# Altium project P-MT3620RDB-1-7.PrjPcb (part 2 of 5)

## Sheet P-MT3620RDB-1-7_PMU.SchDoc: MT3620 RDB PMU
size A3; CompanyName: Microsoft Research; DrawnBy: Stuart Taylor; Revision: 1.7; SheetNumber: 3; SheetTotal: 5; ProjectName: MT3620 Reference Development Board
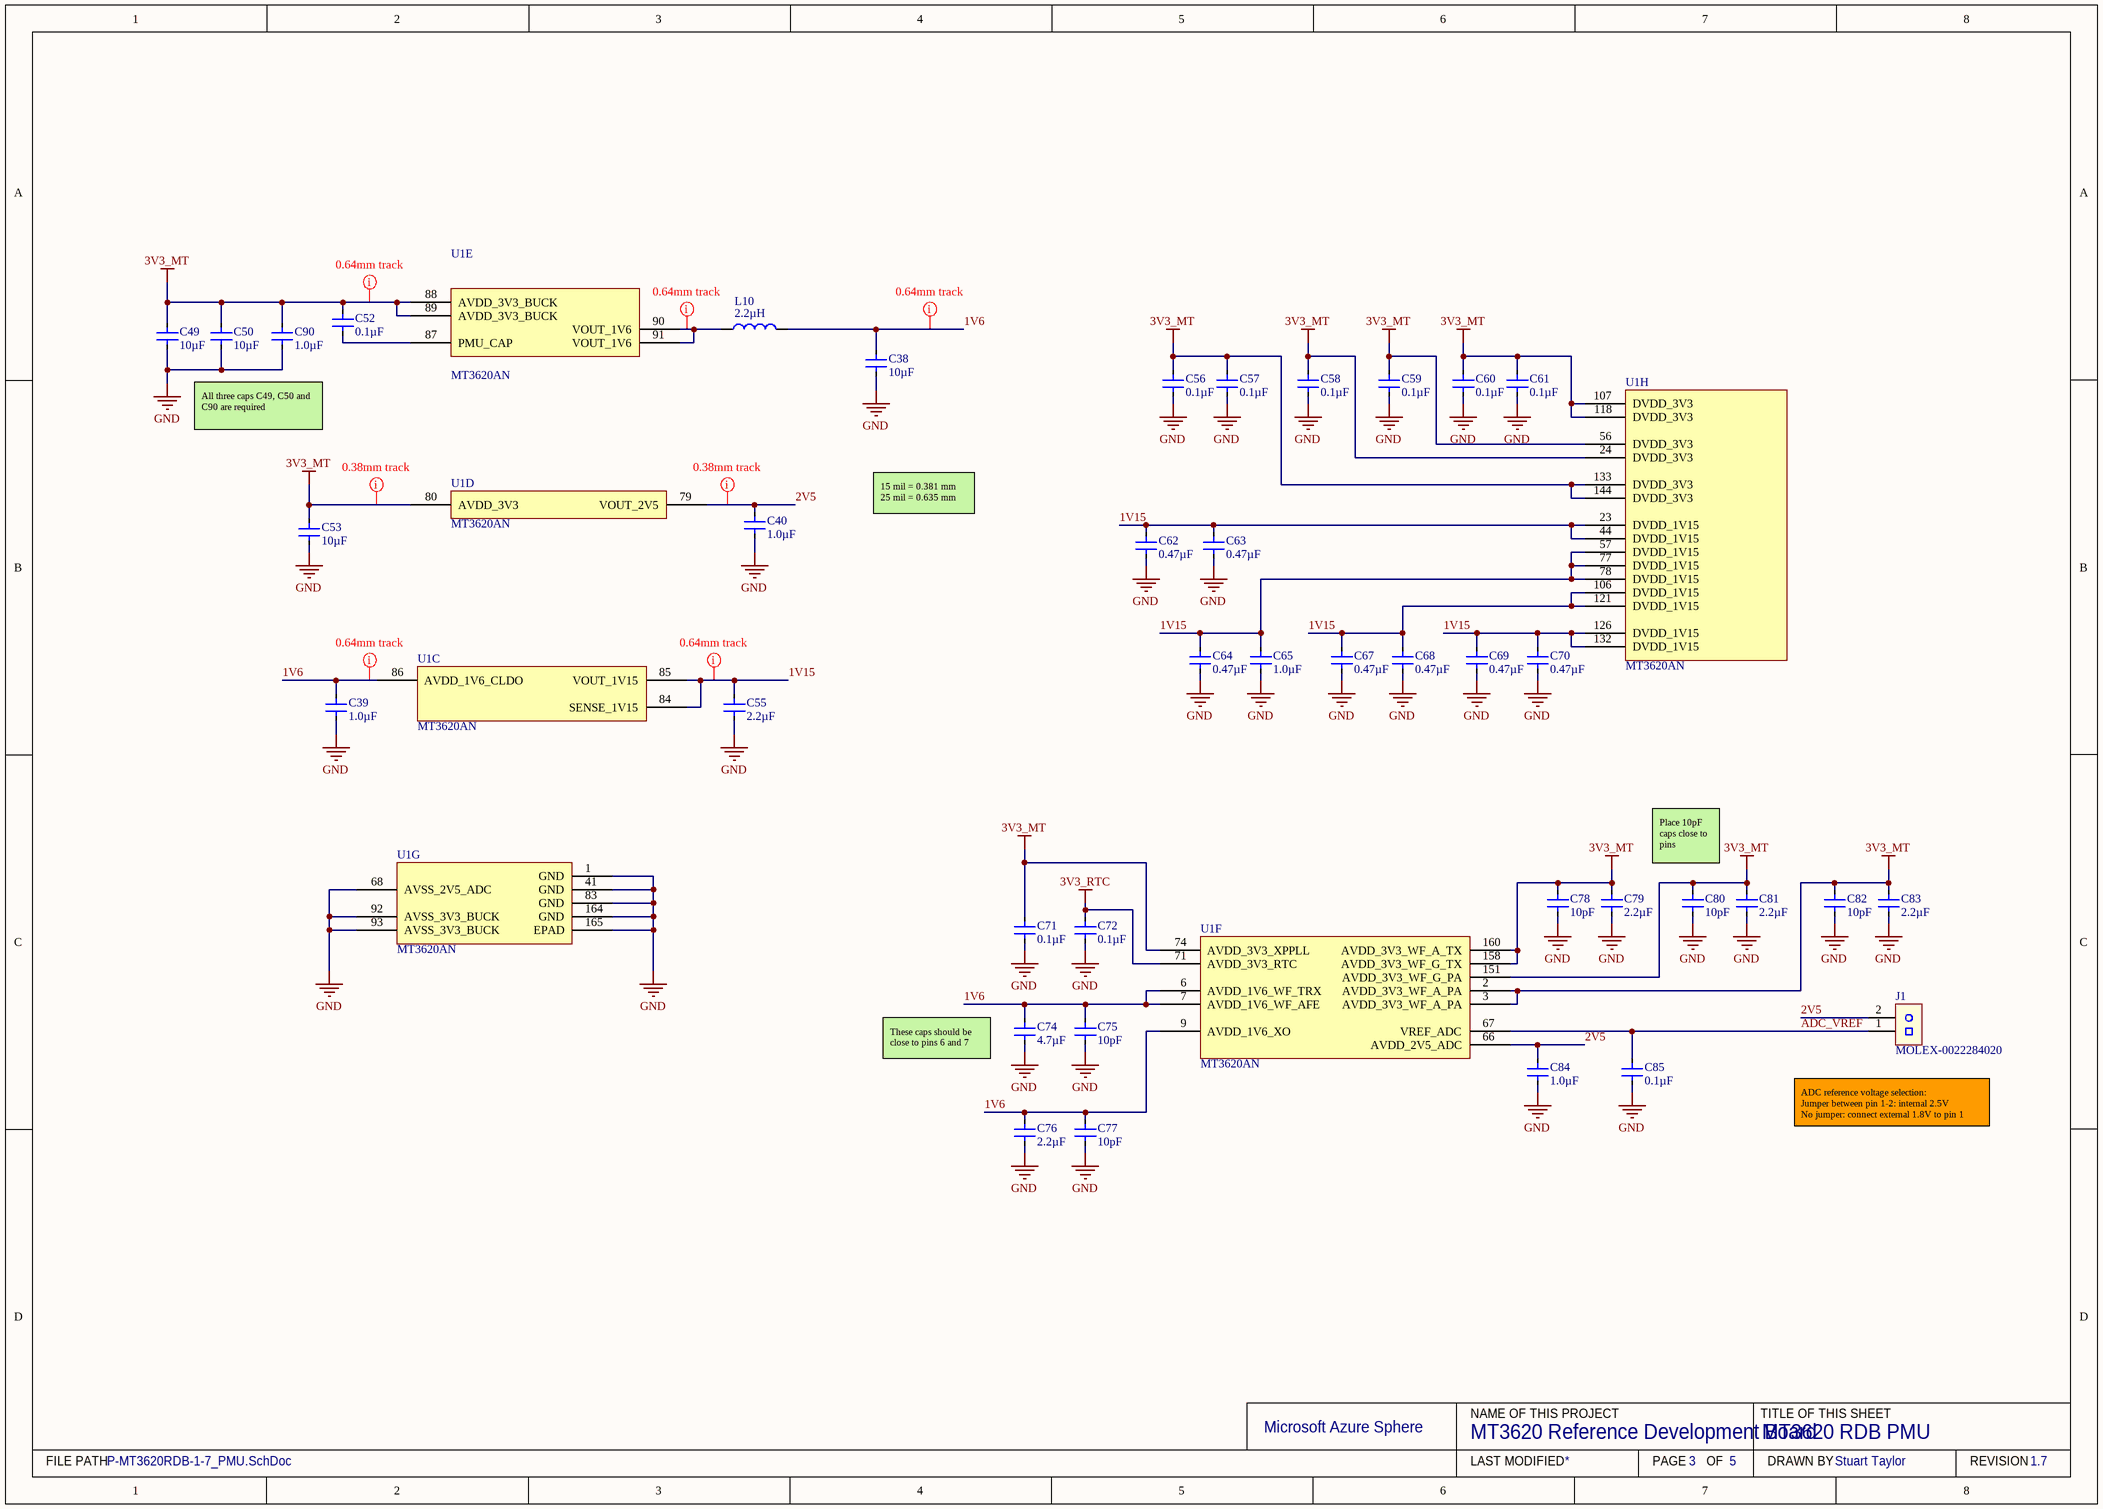
[diagram p2: P-MT3620RDB-1-7_PMU.SchDoc]

### Parts
C38  10µF  [CAPC1608-EIA0603-1MM-MED]
C39  1.0µF  [CAPC1005-EIA0402 0.55MM MED]
C40  1.0µF  [CAPC1005-EIA0402 0.55MM MED]
C49  10µF  [CAPC1005-EIA0402 0.55MM MED]
C50  10µF  [CAPC1005-EIA0402 0.55MM MED]
C52  0.1µF  [CAPC1005-EIA0402 0.55MM MED]
C53  10µF  [CAPC1005-EIA0402 0.55MM MED]
C55  2.2µF  [CAPC1005-EIA0402 0.55MM MED]
C56  0.1µF  [CAPC1005-EIA0402 0.55MM MED]
C57  0.1µF  [CAPC1005-EIA0402 0.55MM MED]
C58  0.1µF  [CAPC1005-EIA0402 0.55MM MED]
C59  0.1µF  [CAPC1005-EIA0402 0.55MM MED]
C60  0.1µF  [CAPC1005-EIA0402 0.55MM MED]
C61  0.1µF  [CAPC1005-EIA0402 0.55MM MED]
C62  0.47µF  [CAPC1005-EIA0402 0.55MM MED]
C63  0.47µF  [CAPC1005-EIA0402 0.55MM MED]
C64  0.47µF  [CAPC1005-EIA0402 0.55MM MED]
C65  1.0µF  [CAPC1005-EIA0402 0.55MM MED]
C67  0.47µF  [CAPC1005-EIA0402 0.55MM MED]
C68  0.47µF  [CAPC1005-EIA0402 0.55MM MED]
C69  0.47µF  [CAPC1005-EIA0402 0.55MM MED]
C70  0.47µF  [CAPC1005-EIA0402 0.55MM MED]
C71  0.1µF  [CAPC1005-EIA0402 0.55MM MED]
C72  0.1µF  [CAPC1005-EIA0402 0.55MM MED]
C74  4.7µF  [CAPC1005-EIA0402 0.55MM MED]
C75  10pF  [CAPC1005-EIA0402 0.55MM MED]
C76  2.2µF  [CAPC1005-EIA0402 0.55MM MED]
C77  10pF  [CAPC1005-EIA0402 0.55MM MED]
C78  10pF  [CAPC1005-EIA0402 0.55MM MED]
C79  2.2µF  [CAPC1005-EIA0402 0.55MM MED]
C80  10pF  [CAPC1005-EIA0402 0.55MM MED]
C81  2.2µF  [CAPC1005-EIA0402 0.55MM MED]
C82  10pF  [CAPC1005-EIA0402 0.55MM MED]
C83  2.2µF  [CAPC1005-EIA0402 0.55MM MED]
C84  1.0µF  [CAPC1005-EIA0402 0.55MM MED]
C85  0.1µF  [CAPC1005-EIA0402 0.55MM MED]
C90  1.0µF  [CAPC1005-EIA0402 0.55MM MED]
J1  MOLEX-0022284020  [0022284020]
L10  2.2µH  [MAMK2520T2R2M]
U1  MT3620AN  [MT3620_MaskSquaresVias50]  (parts C,D,E,F,G,H of 14)

### Nets
3V3_MT: C49.2 C50.2 C52.2 C53.2 C56.2 C57.2 C58.2 C59.2 C60.2 C61.2 C71.2 C78.2 C79.2 C80.2 C81.2 C82.2 C83.2 C90.2 U1.2(AVDD_3V3_WF_A_PA) U1.3(AVDD_3V3_WF_A_PA) U1.24(DVDD_3V3) U1.56(DVDD_3V3) U1.74(AVDD_3V3_XPPLL) U1.80(AVDD_3V3) U1.88(AVDD_3V3_BUCK) U1.89(AVDD_3V3_BUCK) U1.107(DVDD_3V3) U1.118(DVDD_3V3) U1.133(DVDD_3V3) U1.144(DVDD_3V3) U1.151(AVDD_3V3_WF_G_PA) U1.158(AVDD_3V3_WF_G_TX) U1.160(AVDD_3V3_WF_A_TX)
3V3_RTC: C72.2 U1.71(AVDD_3V3_RTC)
GND: C38.1 C39.1 C40.1 C49.1 C50.1 C53.1 C55.1 C56.1 C57.1 C58.1 C59.1 C60.1 C61.1 C62.1 C63.1 C64.1 C65.1 C67.1 C68.1 C69.1 C70.1 C71.1 C72.1 C74.1 C75.1 C76.1 C77.1 C78.1 C79.1 C80.1 C81.1 C82.1 C83.1 C84.1 C85.1 C90.1 U1.1(GND) U1.41(GND) U1.68(AVSS_2V5_ADC) U1.83(GND) U1.92(AVSS_3V3_BUCK) U1.93(AVSS_3V3_BUCK) U1.164(GND) U1.165(EPAD)
1V6: C38.2 C39.2 C74.2 C75.2 C76.2 C77.2 L10.2 U1.6(AVDD_1V6_WF_TRX) U1.7(AVDD_1V6_WF_AFE) U1.9(AVDD_1V6_XO) U1.86(AVDD_1V6_CLDO)
1V15: C55.2 C62.2 C63.2 C64.2 C65.2 C67.2 C68.2 C69.2 C70.2 U1.23(DVDD_1V15) U1.44(DVDD_1V15) U1.57(DVDD_1V15) U1.77(DVDD_1V15) U1.78(DVDD_1V15) U1.84(SENSE_1V15) U1.85(VOUT_1V15) U1.106(DVDD_1V15) U1.121(DVDD_1V15) U1.126(DVDD_1V15) U1.132(DVDD_1V15)
2V5: C40.2 C84.2 J1.2 U1.66(AVDD_2V5_ADC) U1.79(VOUT_2V5)
ADC_VREF: C85.2 J1.1 U1.67(VREF_ADC)
NetC52_1: C52.1 U1.87(PMU_CAP)
NetL10_1: L10.1 U1.90(VOUT_1V6) U1.91(VOUT_1V6)

### Layout directives
rule Undefined: 1V6, 1V15, 2V5, 3V3_MT, NetL10_1

### Notes on the sheet
- All three caps C49, C50 and C90 are required
- 15 mil = 0.381 mm
  25 mil = 0.635 mm
- Place 10pF caps close to pins
- (near C74) These caps should be close to pins 6 and 7
- (near J1) ADC reference voltage selection:
  Jumper between pin 1-2: internal 2.5V
  No jumper: connect external 1.8V to pin 1
- Microsoft Azure Sphere
- NAME OF THIS PROJECT
- TITLE OF THIS SHEET
- FILE PATH
- LAST MODIFIED
- PAGE
- OF
- DRAWN BY
- REVISION

### Library data of the parts
C38 = 10µF 0603 X5R 25V: CAP CER 10UF 25V 20% X5R 0603; Manufacturer: TDK Corporation; Manufacturer Part Number: C1608X5R1E106M080AC; Supplier 1: Digi-Key; RoHS: RoHS Compliant; Category: Capacitors; Stock 1: 47833; Pricing 1: 0.00754; Packaging: Tape & Reel (TR); Tolerance: ±20%; Voltage - Rated: 25V; Temperature Coefficient: X5R; Mounting Type: Surface Mount, MLCC; Operating Temperature: -55°C ~ 125°C; Applications: General Purpose; Package / Case: 0603 (1608 Metric); Size / Dimension: 0.063" L x 0.031" W (1.60mm x 0.80mm); Height - Seated (Max): -; Thickness (Max): 0.039" (1.00mm); Lead Spacing: -; Features: -; Lead Style: -; ComponentLink1URL: http://product.tdk.com/en/catalog/datasheets/mlcc_commercial_general_en.pdf; ComponentLink1Description: http://product.tdk.com/en/catalog/datasheets/mlcc_commercial_general_en.pdf; Supplier Part Number 1: 445-9015-2-ND; Ratings: -; Capacitance: 10µF
C39 C40 C65 C84 C90 = 1.0µF 0402 X5R 35V: CAP CER 1UF 35V 10% X5R 0402; Manufacturer: TDK Corporation; Manufacturer Part Number: C1005X5R1V105K050BC; Supplier 1: Digi-Key; RoHS: RoHS Compliant; Category: Capacitors; Stock 1: 47833; Pricing 1: 0.0186; Packaging: Tape & Reel (TR); Tolerance: ±10%; Voltage - Rated: 35V; Temperature Coefficient: X5R; Mounting Type: Surface Mount, MLCC; Operating Temperature: -55°C ~ 125°C; Applications: General Purpose; Package / Case: 0402 (1005 Metric); Size / Dimension: 0.039" L x 0.020" W (1.00mm x 0.50mm); Height - Seated (Max): -; Thickness (Max): 0.022" (0.55mm); Lead Spacing: -; Features: -; Lead Style: -; ComponentLink1URL: http://product.tdk.com/en/catalog/datasheets/mlcc_commercial_general_en.pdf; ComponentLink1Description: http://product.tdk.com/en/catalog/datasheets/mlcc_commercial_general_en.pdf; Supplier Part Number 1: 445-9073-2-ND; Ratings: -; Capacitance: 1.0µF
C49 C50 C53 = 10µF 0402 X5R 6.3V: CAP CER 10UF 6.3V 20% X5R 0402; Manufacturer: TDK Corporation; Manufacturer Part Number: C1005X5R0J106M050BC; Supplier 1: Digi-Key; RoHS: RoHS Compliant; Category: Capacitors; Stock 1: 47833; Pricing 1: 0.07766; Packaging: Tape & Reel (TR); Tolerance: ±20%; Voltage - Rated: 6.3V; Temperature Coefficient: X5R; Mounting Type: Surface Mount, MLCC; Operating Temperature: -55°C ~ 125°C; Applications: General Purpose; Package / Case: 0402 (1005 Metric); Size / Dimension: 0.039" L x 0.020" W (1.00mm x 0.50mm); Height - Seated (Max): -; Thickness (Max): 0.020" (0.50mm); Lead Spacing: -; Features: -; Lead Style: -; ComponentLink1URL: http://product.tdk.com/en/catalog/datasheets/mlcc_commercial_general_en.pdf; ComponentLink1Description: http://product.tdk.com/en/catalog/datasheets/mlcc_commercial_general_en.pdf; Supplier Part Number 1: 445-8920-2-ND; Ratings: -; Capacitance: 10µF
C52 C56-C61 C71 C72 C85 = 0.1µF 0402 X7R 50V: CAP CER 0.1UF 50V 10% X7R 0402; Manufacturer: TDK Corporation; Manufacturer Part Number: C1005X7R1H104K050BB; Supplier 1: Digi-Key; RoHS: RoHS Compliant; Category: Capacitors; Stock 1: 47833; Pricing 1: 0.01305; Packaging: Tape & Reel (TR); Tolerance: ±10%; Voltage - Rated: 50V; Temperature Coefficient: X7R; Mounting Type: Surface Mount, MLCC; Operating Temperature: -55°C ~ 125°C; Applications: General Purpose; Package / Case: 0402 (1005 Metric); Size / Dimension: 0.039" L x 0.020" W (1.00mm x 0.50mm); Height - Seated (Max): -; Thickness (Max): 0.022" (0.55mm); Lead Spacing: -; Features: -; Lead Style: -; ComponentLink1URL: http://product.tdk.com/en/catalog/datasheets/mlcc_commercial_general_en.pdf; ComponentLink1Description: http://product.tdk.com/en/catalog/datasheets/mlcc_commercial_general_en.pdf; Supplier Part Number 1: 445-5932-2-ND; Ratings: -; Capacitance: 0.1µF
C55 C76 C79 C81 C83 = 2.2µF 0402 X5R 35V: CAP CER 2.2UF 35V 10% X5R 0402; Manufacturer: TDK Corporation; Manufacturer Part Number: C1005X5R1V225K050BC; Supplier 1: Digi-Key; RoHS: RoHS Compliant; Category: Capacitors; Stock 1: 47833; Pricing 1: 0.04177; Packaging: Tape & Reel (TR); Tolerance: ±10%; Voltage - Rated: 35V; Temperature Coefficient: X5R; Mounting Type: Surface Mount, MLCC; Operating Temperature: -55°C ~ 125°C; Applications: General Purpose; Package / Case: 0402 (1005 Metric); Size / Dimension: 0.039" L x 0.020" W (1.00mm x 0.50mm); Height - Seated (Max): -; Thickness (Max): 0.022" (0.55mm); Lead Spacing: -; Features: -; Lead Style: -; ComponentLink1URL: http://product.tdk.com/en/catalog/datasheets/mlcc_commercial_general_en.pdf; ComponentLink1Description: http://product.tdk.com/en/catalog/datasheets/mlcc_commercial_general_en.pdf; Supplier Part Number 1: 445-9028-2-ND; Ratings: -; Capacitance: 2.2µF
C62-C64 C67-C70 = 0.47µF 0402 X5R 35V: CAP CER 0.47UF 35V 10% X5R 0402; Manufacturer: TDK Corporation; Manufacturer Part Number: C1005X5R1V474K050BC; Supplier 1: Digi-Key; RoHS: RoHS Compliant; Category: Capacitors; Stock 1: 47833; Pricing 1: 0.01762; Packaging: Tape & Reel (TR); Tolerance: ±10%; Voltage - Rated: 35V; Temperature Coefficient: X5R; Mounting Type: Surface Mount, MLCC; Operating Temperature: -55°C ~ 125°C; Applications: General Purpose; Package / Case: 0402 (1005 Metric); Size / Dimension: 0.039" L x 0.020" W (1.00mm x 0.50mm); Height - Seated (Max): -; Thickness (Max): 0.022" (0.55mm); Lead Spacing: -; Features: -; Lead Style: -; ComponentLink1URL: http://product.tdk.com/en/catalog/datasheets/mlcc_commercial_general_en.pdf; ComponentLink1Description: http://product.tdk.com/en/catalog/datasheets/mlcc_commercial_general_en.pdf; Supplier Part Number 1: 445-13864-2-ND; Ratings: -; Capacitance: 0.47µF
C74 = 4.7µF 0402 X5R 10V: CAP CER 4.7UF 10V 10% X5R 0402; Manufacturer: TDK Corporation; Manufacturer Part Number: C1005X5R1A475K050BC; Supplier 1: Digi-Key; RoHS: RoHS Compliant; Category: Capacitors; Stock 1: 47833; Pricing 1: 0.06265; Packaging: Tape & Reel (TR); Tolerance: ±10%; Voltage - Rated: 10V; Temperature Coefficient: X5R; Mounting Type: Surface Mount, MLCC; Operating Temperature: -55°C ~ 125°C; Applications: General Purpose; Package / Case: 0402 (1005 Metric); Size / Dimension: 0.039" L x 0.020" W (1.00mm x 0.50mm); Height - Seated (Max): -; Thickness (Max): 0.022" (0.55mm); Lead Spacing: -; Features: -; Lead Style: -; ComponentLink1URL: http://product.tdk.com/en/catalog/datasheets/mlcc_commercial_general_en.pdf; ComponentLink1Description: http://product.tdk.com/en/catalog/datasheets/mlcc_commercial_general_en.pdf; Supplier Part Number 1: 445-13820-2-ND; Ratings: -; Capacitance: 4.7µF
C75 C77 C78 C80 C82 = 10pF 0402 C0G, NP0 50V: CAP CER 10PF 50V NP0 0402; Manufacturer: TDK Corporation; Manufacturer Part Number: C1005C0G1H100D050BA; Tolerance: ±0.5pF; Supplier 1: Digi-Key; RoHS: RoHS Compliant; Category: Capacitors; Stock 1: 47833; Pricing 1: 0.00274; Packaging: Tape & Reel (TR); Voltage - Rated: 50V; Temperature Coefficient: C0G, NP0; Mounting Type: Surface Mount, MLCC; Operating Temperature: -55°C ~ 125°C; Applications: General Purpose; Package / Case: 0402 (1005 Metric); Size / Dimension: 0.039" L x 0.020" W (1.00mm x 0.50mm); Height - Seated (Max): -; Thickness (Max): 0.022" (0.55mm); Lead Spacing: -; Features: -; Lead Style: -; ComponentLink1URL: http://product.tdk.com/en/catalog/datasheets/mlcc_commercial_general_en.pdf; ComponentLink1Description: http://product.tdk.com/en/catalog/datasheets/mlcc_commercial_general_en.pdf; Supplier Part Number 1: 445-1235-2-ND; Ratings: -; Capacitance: 10pF
J1 = MOLEX-0022284020: CONN HEADER 2POS .100 VERT TIN; Manufacturer: Molex, LLC; Connector Type: Header, Unshrouded, Breakaway; Number of Positions: 2; Number of Positions Loaded: All; Pitch: 0.100" (2.54mm); Supplier 1: Digi-Key; Manufacturer Part Number: 0022284020; RoHS: RoHS Compliant; Category: Connectors, Interconnects; Stock 1: 10077; Pricing 1: 1=0.12, 10=0.108, 25=0.0808, 50=0.0692, 100=0.0668, 250=0.0576, 500=0.0553 (GBP); Packaging: Bulk; Contact Type: Male Pin; Number of Rows: 1; Row Spacing: -; Contact Mating Length: 0.240" (6.10mm); Mounting Type: Through Hole; Termination: Solder; Fastening Type: -; Features: -; Contact Finish: Tin; Contact Finish Thickness: 100µin (2.54µm); Color: Black; ComponentLink1URL: http://www.molex.com/pdm_docs/sd/022284020_sd.pdf; ComponentLink1Description: http://www.molex.com/pdm_docs/sd/022284020_sd.pdf; Supplier Part Number 1: WM50014-02-ND
L10 = MAMK2520T2R2M: FIXED IND 2.2UH 1.9A 117 MOHM; Manufacturer: Taiyo Yuden; Type: Wirewound; Material - Core: Metal; Tolerance: ±20%; Current - Saturation: 2A; Shielding: Shielded; DC Resistance (DCR): 117 mOhm Max; Frequency - Test: 2MHz; Supplier 1: Digi-Key; Manufacturer Part Number: MAMK2520T2R2M; RoHS: RoHS Compliant; Category: Inductors, Coils, Chokes; Stock 1: 7120; Pricing 1: 1=0.34, 10=0.306, 25=0.2864, 50=0.2482, 100=0.2291, 250=0.21768, 500=0.19858, 1000=0.16803 (GBP); Packaging: Cut Tape (CT); Inductance: 2.2µH; Current Rating: 1.9A; Q @ Freq: -; Frequency - Self Resonant: -; Ratings: -; Operating Temperature: -40°C ~ 105°C; Mounting Type: Surface Mount; Package / Case: 1008 (2520 Metric); Size / Dimension: 0.098" L x 0.079" W (2.50mm x 2.00mm); Height - Seated (Max): 0.047" (1.20mm); ComponentLink1URL: http://ds.yuden.co.jp/TYCOMPAS/ut/detail.do?productNo=MAMK2520T2R2M&fileName=MAMK2520T2R2M_SS&mode=specSheetDownload; ComponentLink1Description: http://ds.yuden.co.jp/TYCOMPAS/ut/detail.do?productNo=MAMK2520T2R2M&fileName=MAMK2520T2R2M_SS&mode=specSheetDownload; Supplier Part Number 1: 587-3226-1-ND
U1 = MT3620AN: Manufacturer: MediaTek Inc.; Manufacturer Part Number: MT3620AN; Supplier Part Number 1: MT3620AN; Supplier 1: MediaTek Inc.

## Sheet P-MT3620RDB-1-7_FTDI.SchDoc: MT3620 RDB FTDI
size A3; CompanyName: Microsoft Research; DrawnBy: Stuart Taylor; Revision: 1.7; SheetNumber: 4; SheetTotal: 5; ProjectName: MT3620 Reference Development Board
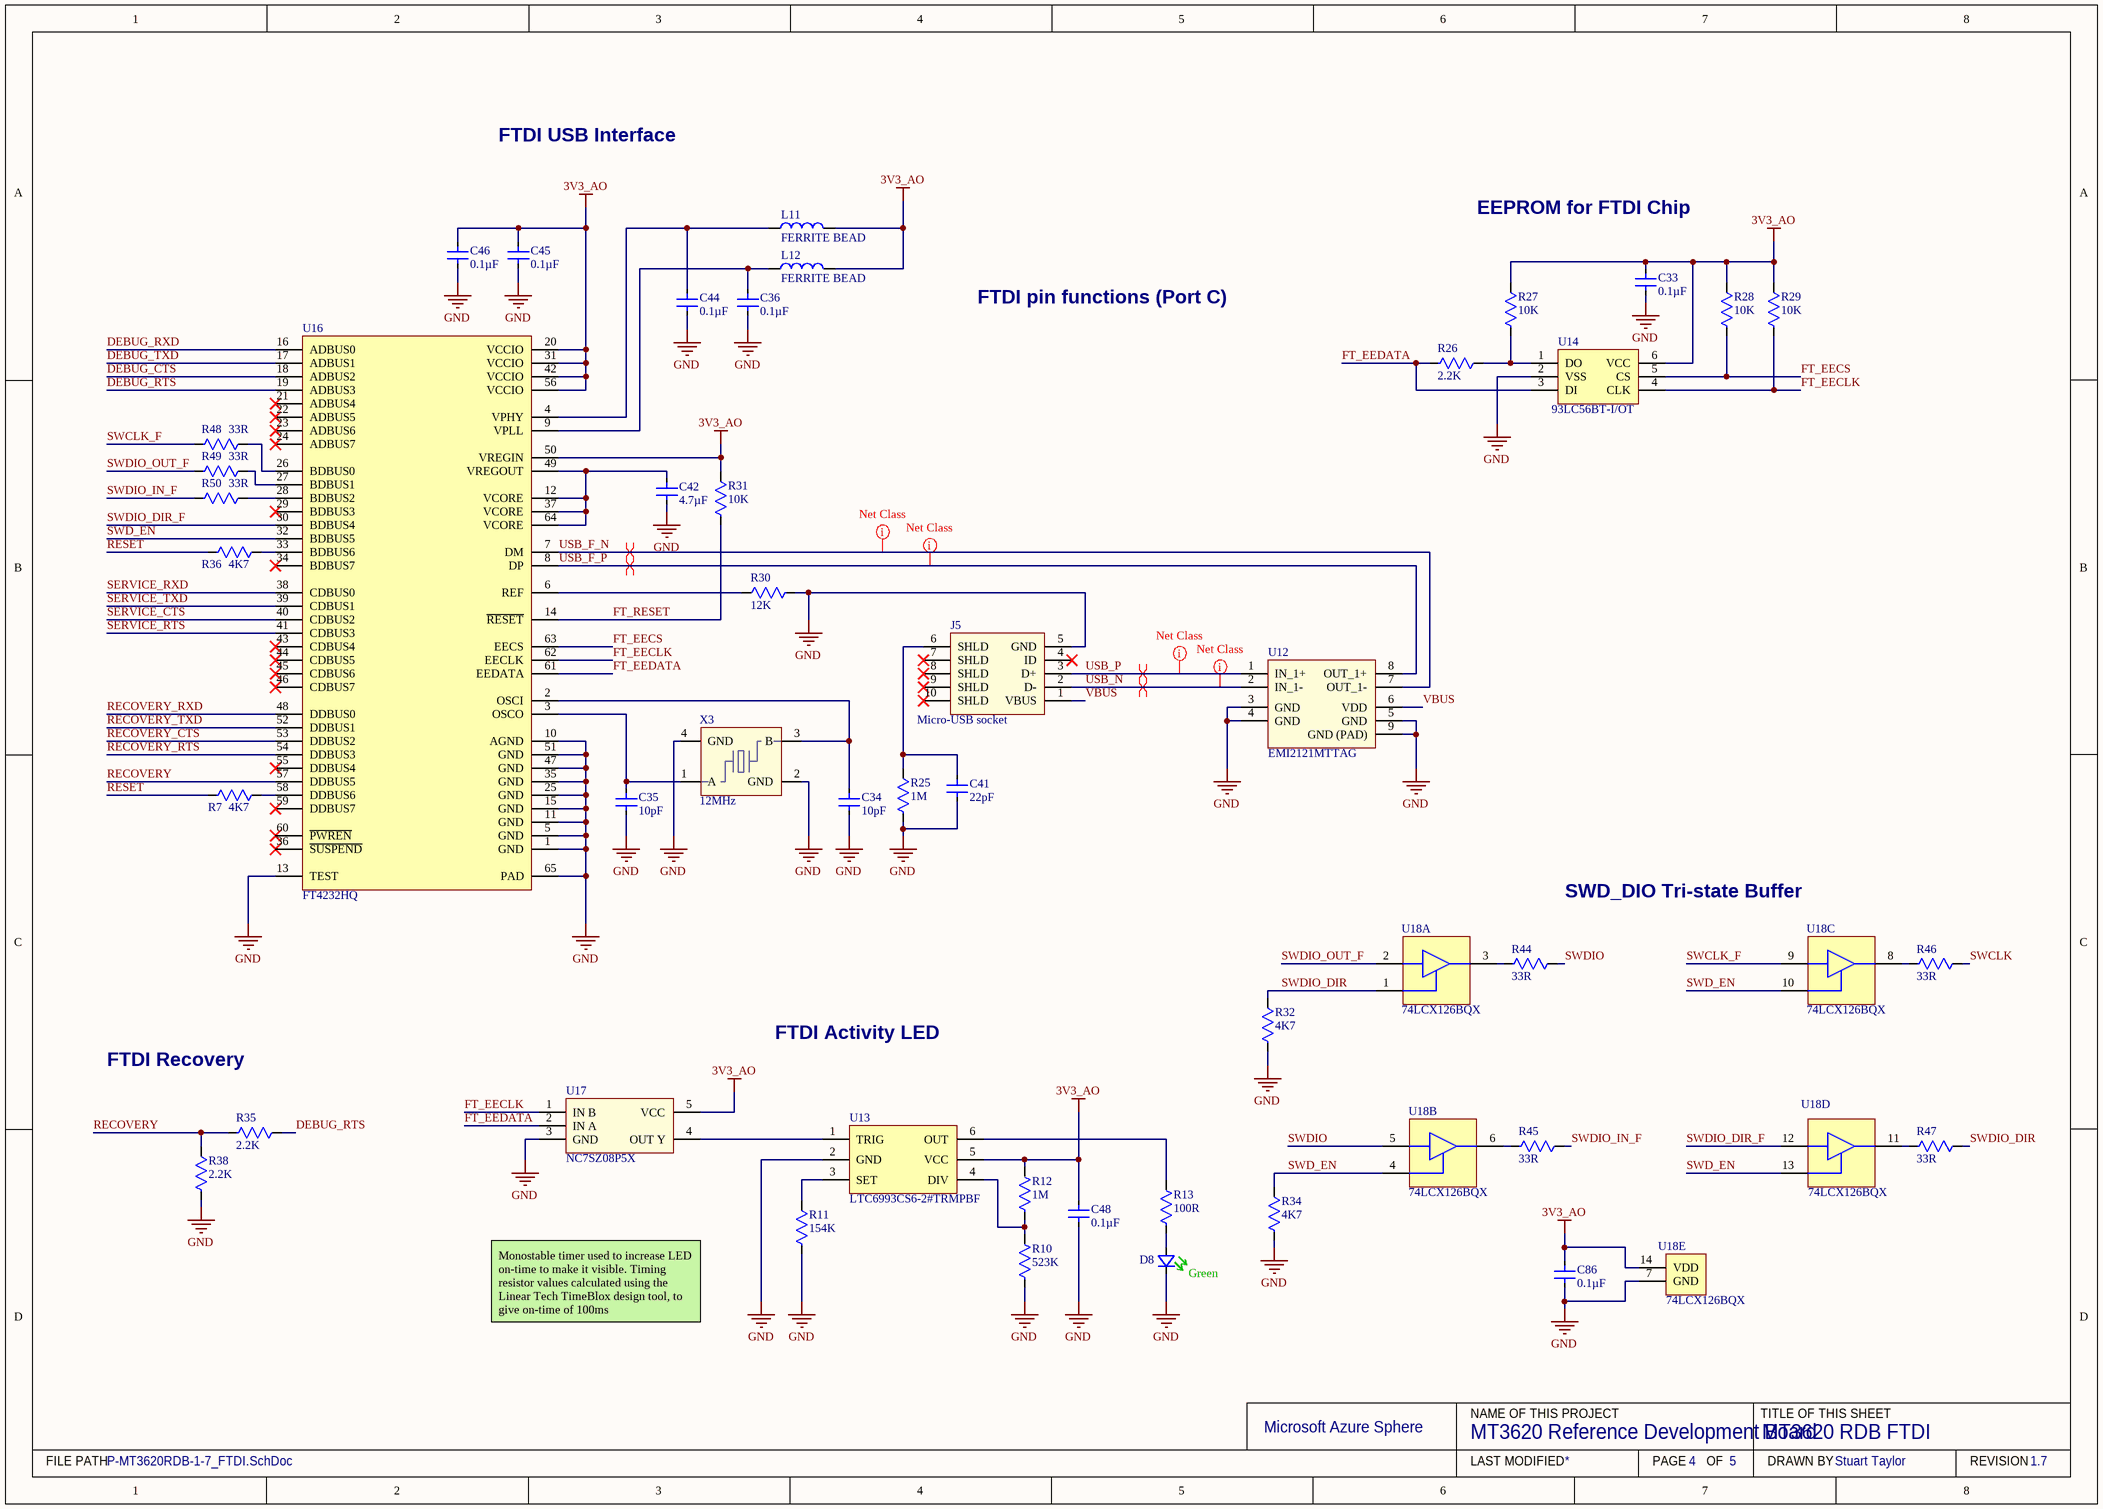
[diagram p3: P-MT3620RDB-1-7_FTDI.SchDoc]

### Parts
C33  0.1µF  [CAPC1005-EIA0402 0.55MM MED]
C34  10pF  [CAPC1005-EIA0402 0.55MM MED]
C35  10pF  [CAPC1005-EIA0402 0.55MM MED]
C36  0.1µF  [CAPC1005-EIA0402 0.55MM MED]
C41  22pF  [CAPC1005-EIA0402 0.55MM MED]
C42  4.7µF  [CAPC1005-EIA0402 0.55MM MED]
C44  0.1µF  [CAPC1005-EIA0402 0.55MM MED]
C45  0.1µF  [CAPC1005-EIA0402 0.55MM MED]
C46  0.1µF  [CAPC1005-EIA0402 0.55MM MED]
C48  0.1µF  [CAPC1005-EIA0402 0.55MM MED]
C86  0.1µF  [CAPC1005-EIA0402 0.55MM MED]
D8  Colour: Green  [Rohm SML-D12 Green]  (hidden comment: Green LED)
J5  Micro-USB socket  [MCR-B-S-RA-SMT-CS5-T/R]
L11  FERRITE BEAD  [CAPC1005-EIA0402 0.55MM MED]
L12  FERRITE BEAD  [CAPC1005-EIA0402 0.55MM MED]
R7  4K7  [RES 0402 MEDIUM DENSITY]
R10  523K  [RES 0402 MEDIUM DENSITY]
R11  154K  [RES 0402 MEDIUM DENSITY]
R12  1M  [RES 0402 MEDIUM DENSITY]
R13  100R  [RES 0402 MEDIUM DENSITY]
R25  1M  [RES 0402 MEDIUM DENSITY]
R26  2.2K  [RES 0402 MEDIUM DENSITY]
R27  10K  [RES 0402 MEDIUM DENSITY]
R28  10K  [RES 0402 MEDIUM DENSITY]
R29  10K  [RES 0402 MEDIUM DENSITY]
R30  12K  [RES 0402 MEDIUM DENSITY]
R31  10K  [RES 0402 MEDIUM DENSITY]
R32  4K7  [RES 0402 MEDIUM DENSITY]
R34  4K7  [RES 0402 MEDIUM DENSITY]
R35  2.2K  [RES 0402 MEDIUM DENSITY]
R36  4K7  [RES 0402 MEDIUM DENSITY]
R38  2.2K  [RES 0402 MEDIUM DENSITY]
R44  33R  [RES 0402 MEDIUM DENSITY]
R45  33R  [RES 0402 MEDIUM DENSITY]
R46  33R  [RES 0402 MEDIUM DENSITY]
R47  33R  [RES 0402 MEDIUM DENSITY]
R48  33R  [RES 0402 MEDIUM DENSITY]
R49  33R  [RES 0402 MEDIUM DENSITY]
R50  33R  [RES 0402 MEDIUM DENSITY]
U12  EMI2121MTTAG  [EMI2121MTTAG]
U13  LTC6993CS6-2#TRMPBF  [LTC6993CS6-2#TRMPBF]
U14  93LC56BT-I/OT  [SOT23-93C56B]
U16  FT4232HQ  [FTDI_TF4232HQ_64QFN]
U17  NC7SZ08P5X  [SC-70-5]
U18  74LCX126BQX  [74LCX126BQX]  (parts A,B,C,D,E of 5)
X3  12MHz  [TXC 8Z]

### Nets
3V3_AO: C33.2 C45.2 C46.2 C48.2 C86.2 L11.2 L12.2 R12.1 R27.1 R28.1 R29.1 R31.1 U13.5(VCC) U14.6(VCC) U16.20(VCCIO) U16.31(VCCIO) U16.42(VCCIO) U16.50(VREGIN) U16.56(VCCIO) U17.5(VCC) U18.14(VDD)
GND: C33.1 C34.1 C35.1 C36.1 C41.1 C42.1 C44.1 C45.1 C46.1 C48.1 C86.1 D8.1(K) J5.5(GND) R10.2 R11.2 R25.2 R30.2 R32.2 R34.2 R38.2 U12.3(GND) U12.4(GND) U12.5(GND) U12.9(GND_(PAD)) U13.2(GND) U14.2(VSS) U16.1(GND) U16.5(GND) U16.10(AGND) U16.11(GND) U16.13(TEST) U16.15(GND) U16.25(GND) U16.35(GND) U16.47(GND) U16.51(GND) U16.65(PAD) U17.3(GND) U18.7(GND) X3.2(GND) X3.4(GND)
VBUS: J5.1(VBUS) U12.6(VDD)
DEBUG_CTS: U16.18(ADBUS2)
DEBUG_RTS: R35.1 U16.19(ADBUS3)
DEBUG_RXD: U16.16(ADBUS0)
DEBUG_TXD: U16.17(ADBUS1)
FT_EECLK: R29.2 U14.4(CLK) U16.62(EECLK) U17.1(IN_B)
FT_EECS: R28.2 U14.5(CS) U16.63(EECS)
FT_EEDATA: R26.2 U14.3(DI) U16.61(EEDATA) U17.2(IN_A)
FT_RESET: R31.2 U16.14(~{RESET})
RECOVERY: R35.2 R38.1 U16.57(DDBUS5)
RECOVERY_CTS: U16.53(DDBUS2)
RECOVERY_RTS: U16.54(DDBUS3)
RECOVERY_RXD: U16.48(DDBUS0)
RECOVERY_TXD: U16.52(DDBUS1)
RESET: R7.2 R36.2
SERVICE_CTS: U16.40(CDBUS2)
SERVICE_RTS: U16.41(CDBUS3)
SERVICE_RXD: U16.38(CDBUS0)
SERVICE_TXD: U16.39(CDBUS1)
SWCLK: R46.1
SWCLK_F: R48.2 U18.9(3A)
SWD_EN: R34.1 U16.32(BDBUS5) U18.4(2OE) U18.10(3OE) U18.13(4OE)
SWDIO: R44.1 U18.5(2A)
SWDIO_DIR: R32.1 R47.1 U18.1(1OE)
SWDIO_DIR_F: U16.30(BDBUS4) U18.12(4A)
SWDIO_IN_F: R45.1 R50.2
SWDIO_OUT_F: R49.2 U18.2(1A)
USB_F_N: U12.7(OUT_1-) U16.7(DM)
USB_F_P: U12.8(OUT_1+) U16.8(DP)
USB_N: J5.2(D-) U12.2(IN_1-)
USB_P: J5.3(D+) U12.1(IN_1+)
NetC34_2: C34.2 U16.2(OSCI) X3.3(B)
NetC35_2: C35.2 U16.3(OSCO) X3.1(A)
NetC36_2: C36.2 L12.1 U16.9(VPLL)
NetC41_2: C41.2 J5.6(SHLD) R25.1
NetC42_2: C42.2 U16.12(VCORE) U16.37(VCORE) U16.49(VREGOUT) U16.64(VCORE)
NetC44_2: C44.2 L11.1 U16.4(VPHY)
NetD8_2: D8.2(A) R13.2
NetR7_1: R7.1 U16.58(DDBUS6)
NetR10_1: R10.1 R12.2 U13.4(DIV)
NetR11_1: R11.1 U13.3(SET)
NetR13_1: R13.1 U13.6(OUT)
NetR26_1: R26.1 R27.2 U14.1(DO)
NetR30_1: R30.1 U16.6(REF)
NetR36_1: R36.1 U16.33(BDBUS6)
NetR44_2: R44.2 U18.3(1Y)
NetR45_2: R45.2 U18.6(2Y)
NetR46_2: R46.2 U18.8(3Y)
NetR47_2: R47.2 U18.11(4Y)
NetR48_1: R48.1 U16.26(BDBUS0)
NetR49_1: R49.1 U16.27(BDBUS1)
NetR50_1: R50.1 U16.28(BDBUS2)
NetU13_1: U13.1(TRIG) U17.4(OUT_Y)

Not connected (* = marked no-connect by the designer): J5 4(ID)* 7(SHLD)* 8(SHLD)* 9(SHLD)* 10(SHLD)*; U16 21(ADBUS4)* 22(ADBUS5)* 23(ADBUS6)* 24(ADBUS7)* 29(BDBUS3)* 34(BDBUS7)* 36(~{SUSPEND})* 43(CDBUS4)* 44(CDBUS5)* 45(CDBUS6)* 46(CDBUS7)* 55(DDBUS4)* 59(DDBUS7)* 60(~{PWREN})*

### Layout directives
differential pair: USB_F_N, USB_F_P, USB_N, USB_P
net class USB: USB_F_N, USB_F_P, USB_N, USB_P

### Notes on the sheet
- FTDI USB Interface
- EEPROM for FTDI Chip
- FTDI pin functions (Port C)
- SWD_DIO Tri-state Buffer
- FTDI Activity LED
- FTDI Recovery
- Monostable timer used to increase LED on-time to make it visible. Timing resistor values calculated using the Linear Tech TimeBlox design tool, to give on-time of 100ms
- Microsoft Azure Sphere
- NAME OF THIS PROJECT
- TITLE OF THIS SHEET
- FILE PATH
- LAST MODIFIED
- PAGE
- OF
- DRAWN BY
- REVISION

### Library data of the parts
C33 C36 C44-C46 C48 C86 = 0.1µF 0402 X7R 50V: as C52 on sheet P-MT3620RDB-1-7_PMU; Supplier 1: Digi-Key; RoHS: RoHS Compliant; Category: Capacitors; Stock 1: 47833; Pricing 1: 0.01305; Packaging: Tape & Reel (TR); Tolerance: ±10%; Voltage - Rated: 50V; Temperature Coefficient: X7R; Mounting Type: Surface Mount, MLCC; Operating Temperature: -55°C ~ 125°C; Applications: General Purpose; Package / Case: 0402 (1005 Metric); Size / Dimension: 0.039" L x 0.020" W (1.00mm x 0.50mm); Height - Seated (Max): -; Thickness (Max): 0.022" (0.55mm); Lead Spacing: -; Features: -; Lead Style: -; ComponentLink1URL: http://product.tdk.com/en/catalog/datasheets/mlcc_commercial_general_en.pdf; ComponentLink1Description: http://product.tdk.com/en/catalog/datasheets/mlcc_commercial_general_en.pdf; Supplier Part Number 1: 445-5932-2-ND; Ratings: -; Capacitance: 0.1µF
C34 C35 = 10pF 0402 C0G, NP0 50V: as C75 on sheet P-MT3620RDB-1-7_PMU; Supplier 1: Digi-Key; RoHS: RoHS Compliant; Category: Capacitors; Stock 1: 47833; Pricing 1: 0.00274; Packaging: Tape & Reel (TR); Voltage - Rated: 50V; Temperature Coefficient: C0G, NP0; Mounting Type: Surface Mount, MLCC; Operating Temperature: -55°C ~ 125°C; Applications: General Purpose; Package / Case: 0402 (1005 Metric); Size / Dimension: 0.039" L x 0.020" W (1.00mm x 0.50mm); Height - Seated (Max): -; Thickness (Max): 0.022" (0.55mm); Lead Spacing: -; Features: -; Lead Style: -; ComponentLink1URL: http://product.tdk.com/en/catalog/datasheets/mlcc_commercial_general_en.pdf; ComponentLink1Description: http://product.tdk.com/en/catalog/datasheets/mlcc_commercial_general_en.pdf; Supplier Part Number 1: 445-1235-2-ND; Ratings: -; Capacitance: 10pF
C41 = 22pF 0402 C0G, NP0 50V: CAP CER 22PF 50V 5% NP0 0402; Manufacturer: TDK Corporation; Manufacturer Part Number: C1005C0G1H220J050BA; Supplier 1: Digi-Key; RoHS: RoHS Compliant; Category: Capacitors; Stock 1: 47833; Pricing 1: 0.00274; Packaging: Tape & Reel (TR); Tolerance: ±5%; Voltage - Rated: 50V; Temperature Coefficient: C0G, NP0; Mounting Type: Surface Mount, MLCC; Operating Temperature: -55°C ~ 125°C; Applications: General Purpose; Package / Case: 0402 (1005 Metric); Size / Dimension: 0.039" L x 0.020" W (1.00mm x 0.50mm); Height - Seated (Max): -; Thickness (Max): 0.022" (0.55mm); Lead Spacing: -; Features: -; Lead Style: -; ComponentLink1URL: http://product.tdk.com/en/catalog/datasheets/mlcc_commercial_general_en.pdf; ComponentLink1Description: http://product.tdk.com/en/catalog/datasheets/mlcc_commercial_general_en.pdf; Supplier Part Number 1: 445-1239-2-ND; Ratings: -; Capacitance: 22pF
C42 = 4.7µF 0402 X5R 10V: as C74 on sheet P-MT3620RDB-1-7_PMU; Supplier 1: Digi-Key; RoHS: RoHS Compliant; Category: Capacitors; Stock 1: 47833; Pricing 1: 0.06265; Packaging: Tape & Reel (TR); Tolerance: ±10%; Voltage - Rated: 10V; Temperature Coefficient: X5R; Mounting Type: Surface Mount, MLCC; Operating Temperature: -55°C ~ 125°C; Applications: General Purpose; Package / Case: 0402 (1005 Metric); Size / Dimension: 0.039" L x 0.020" W (1.00mm x 0.50mm); Height - Seated (Max): -; Thickness (Max): 0.022" (0.55mm); Lead Spacing: -; Features: -; Lead Style: -; ComponentLink1URL: http://product.tdk.com/en/catalog/datasheets/mlcc_commercial_general_en.pdf; ComponentLink1Description: http://product.tdk.com/en/catalog/datasheets/mlcc_commercial_general_en.pdf; Supplier Part Number 1: 445-13820-2-ND; Ratings: -; Capacitance: 4.7µF
D8 = SML-D12P: 1.6 x 0.8 x 0.55mm (0603) LED 560nm Green; Manufacturer: Rohm Semiconductor; Manufacturer Part Number: SML-D12P8WT86; Millicandela Rating: 6.3mcd; Voltage - Forward (Vf) (Typ): 2.2V; Current - Test: 20mA; Lens Type: Diffused, White; Lens Style/Size: Rectangle with Flat Top, 1.2mm x 0.8mm; Supplier 1: Digi-Key; RoHS: RoHS Compliant; Category: Optoelectronics; Stock 1: 19305; Pricing 1: 1=0.38, 10=0.279, 25=0.2232, 100=0.1478, 250=0.1046, 500=0.08926, 1000=0.06974 (GBP); Packaging: Cut Tape (CT); Wavelength - Dominant: 560nm; Wavelength - Peak: -; Viewing Angle: -; Package / Case: 0603 (1608 Metric); Size / Dimension: 1.60mm L x 0.80mm W; Height: 0.55mm; Mounting Type: Surface Mount; Luminous Flux @ Current - Test: -; ComponentLink1URL: http://rohmfs.rohm.com/en/products/databook/datasheet/opto/led/chip_mono/sml-d1.pdf; ComponentLink1Description: http://rohmfs.rohm.com/en/products/databook/datasheet/opto/led/chip_mono/sml-d1.pdf; Supplier Part Number 1: 511-1579-1-ND
J5 = MCR-B-S-RA-SMT-CS5-T/R: Manufacturer: Adam Tech; Manufacturers Part Number: MCR-B-S-RA-SMT-CS5-T/R; Supplier Part Number 1: MCR-B-S-RA-SMT-CS5-T/R; Supplier 1: Adam Tech
L11 L12 = BLM15PD121SN1D: FERRITE BEAD 120 OHM 0402 1LN; Manufacturer: Murata Electronics North America; Filter Type: Power Line; Number of Lines: 1; Impedance @ Frequency: 120 Ohm @ 100MHz; Current Rating (Max): 1.3A; DC Resistance (DCR) (Max): 90 mOhm; Supplier 1: Digi-Key; Manufacturer Part Number: BLM15PD121SN1D; RoHS: RoHS Compliant; Category: Filters; Stock 1: 50000; Pricing 1: 10000=0.01677, 20000=0.01557, 30000=0.0154, 50000=0.01498 (GBP); Packaging: Tape & Reel (TR); Ratings: -; Operating Temperature: -55°C ~ 125°C; Package / Case: 0402 (1005 Metric); Mounting Type: Surface Mount; Height (Max): 0.022" (0.55mm); Size / Dimension: 0.039" L x 0.020" W (1.00mm x 0.50mm); ComponentLink1URL: http://search.murata.co.jp/Ceramy/image/img/PDF/ENG/L0110S0100BLM15PG~BLM15PD.pdf; ComponentLink1Description: http://search.murata.co.jp/Ceramy/image/img/PDF/ENG/L0110S0100BLM15PG~BLM15PD.pdf; Supplier Part Number 1: 490-5203-2-ND
R7 R32 R34 R36 = 4.7K: RES 4.7K OHM 1/10W 1% 0402 SMD; Manufacturer: Panasonic Electronic Components; Manufacturer Part Number: ERJ-2RKF4701X; Power (Watts): 0.1W, 1/10W; Temperature Coefficient: ±100ppm/°C; Supplier 1: Digi-Key; Supplier Part Number 1: P4.70KLCT-ND; RoHS: RoHS Compliant; Category: Resistors; Stock 1: 1251398; Pricing 1: 1=0.07, 50=0.0128, 100=0.0097, 250=0.0072, 500=0.00532, 1000=0.00355, 5000=0.0025 (GBP); Packaging: Cut Tape (CT); Tolerance: ±1%; Composition: Thick Film; Features: -; Package / Case: 0402 (1005 Metric); Supplier Device Package: 0402; Size / Dimension: 0.039" L x 0.020" W (1.00mm x 0.50mm); Height: 0.016" (0.40mm); Number of Terminations: 2; ComponentLink1URL: http://industrial.panasonic.com/www-cgi/jvcr13pz.cgi?E+PZ+3+AOA0002+ERJ2RKF4701X+7+WW; ComponentLink1Description: http://industrial.panasonic.com/www-cgi/jvcr13pz.cgi?E+PZ+3+AOA0002+ERJ2RKF4701X+7+WW; Resistance (Ohms): 4K7
R10 = 523K: RES 523K OHM 1/10W 1% 0402 SMD; Manufacturer: Panasonic Electronic Components; Manufacturer Part Number: ERJ-2RKF5233X; Power (Watts): 0.1W, 1/10W; Temperature Coefficient: ±100ppm/°C; Supplier 1: Digi-Key; Supplier Part Number 1: P523KLCT-ND; RoHS: RoHS Compliant; Category: Resistors; Stock 1: 62611; Pricing 1: 1=0.07, 50=0.0128, 100=0.0097, 250=0.0072, 500=0.00532, 1000=0.00355, 5000=0.0025 (GBP); Packaging: Cut Tape (CT); Tolerance: ±1%; Composition: Thick Film; Features: -; Package / Case: 0402 (1005 Metric); Supplier Device Package: 0402; Size / Dimension: 0.039" L x 0.020" W (1.00mm x 0.50mm); Height: 0.016" (0.40mm); Number of Terminations: 2; ComponentLink1URL: http://industrial.panasonic.com/www-cgi/jvcr13pz.cgi?E+PZ+3+AOA0002+ERJ2RKF5233X+7+WW; ComponentLink1Description: http://industrial.panasonic.com/www-cgi/jvcr13pz.cgi?E+PZ+3+AOA0002+ERJ2RKF5233X+7+WW; Resistance (Ohms): 523K
R11 = 154K: RES 154K OHM 1/10W 1% 0402 SMD; Manufacturer: Panasonic Electronic Components; Manufacturer Part Number: ERJ-2RKF1543X; Power (Watts): 0.1W, 1/10W; Temperature Coefficient: ±100ppm/°C; Supplier 1: Digi-Key; Supplier Part Number 1: P154KLCT-ND; RoHS: RoHS Compliant; Category: Resistors; Stock 1: 93656; Pricing 1: 1=0.07, 50=0.0128, 100=0.0097, 250=0.0072, 500=0.00532, 1000=0.00355, 5000=0.0025 (GBP); Packaging: Cut Tape (CT); Tolerance: ±1%; Composition: Thick Film; Features: -; Package / Case: 0402 (1005 Metric); Supplier Device Package: 0402; Size / Dimension: 0.039" L x 0.020" W (1.00mm x 0.50mm); Height: 0.016" (0.40mm); Number of Terminations: 2; ComponentLink1URL: http://industrial.panasonic.com/www-cgi/jvcr13pz.cgi?E+PZ+3+AOA0002+ERJ2RKF1543X+7+WW; ComponentLink1Description: http://industrial.panasonic.com/www-cgi/jvcr13pz.cgi?E+PZ+3+AOA0002+ERJ2RKF1543X+7+WW; Resistance (Ohms): 154K
R12 R25 = 1M: RES 1M OHM 1/10W 1% 0402 SMD; Manufacturer: Panasonic Electronic Components; Manufacturer Part Number: ERJ-2RKF1004X; Power (Watts): 0.1W, 1/10W; Temperature Coefficient: ±100ppm/°C; Supplier 1: Digi-Key; Supplier Part Number 1: P1.00MLCT-ND; RoHS: RoHS Compliant; Category: Resistors; Stock 1: 749171; Pricing 1: 1=0.07, 50=0.0128, 100=0.0097, 250=0.0072, 500=0.00532, 1000=0.00355, 5000=0.0025 (GBP); Packaging: Cut Tape (CT); Tolerance: ±1%; Composition: Thick Film; Features: -; Package / Case: 0402 (1005 Metric); Supplier Device Package: 0402; Size / Dimension: 0.039" L x 0.020" W (1.00mm x 0.50mm); Height: 0.016" (0.40mm); Number of Terminations: 2; ComponentLink1URL: http://industrial.panasonic.com/www-cgi/jvcr13pz.cgi?E+PZ+3+AOA0002+ERJ2RKF1004X+7+WW; ComponentLink1Description: http://industrial.panasonic.com/www-cgi/jvcr13pz.cgi?E+PZ+3+AOA0002+ERJ2RKF1004X+7+WW; Resistance (Ohms): 1M
R13 = 100R: RES 100 OHM 1/10W 1% 0402 SMD; Manufacturer: Panasonic Electronic Components; Manufacturer Part Number: ERJ-2RKF1000X; Power (Watts): 0.1W, 1/10W; Temperature Coefficient: ±100ppm/°C; Supplier 1: Digi-Key; RoHS: RoHS Compliant; Category: Resistors; Stock 1: 3662159; Pricing 1: 1=0.07, 50=0.0128, 100=0.0097, 250=0.0072, 500=0.00532, 1000=0.00355, 5000=0.0025 (GBP); Packaging: Cut Tape (CT); Tolerance: ±1%; Composition: Thick Film; Features: -; Package / Case: 0402 (1005 Metric); Supplier Device Package: 0402; Size / Dimension: 0.039" L x 0.020" W (1.00mm x 0.50mm); Height: 0.016" (0.40mm); Number of Terminations: 2; ComponentLink1URL: http://industrial.panasonic.com/www-cgi/jvcr13pz.cgi?E+PZ+3+AOA0002+ERJ2RKF1000X+7+WW; ComponentLink1Description: http://industrial.panasonic.com/www-cgi/jvcr13pz.cgi?E+PZ+3+AOA0002+ERJ2RKF1000X+7+WW; Supplier Part Number 1: P100LCT-ND; Resistance (Ohms): 100R
R26 R35 R38 = 2.2K: RES 2.2K OHM 1/10W 1% 0402 SMD; Manufacturer: Panasonic Electronic Components; Manufacturer Part Number: ERJ-2RKF2201X; Power (Watts): 0.1W, 1/10W; Temperature Coefficient: ±100ppm/°C; Supplier 1: Digi-Key; Supplier Part Number 1: P2.20KLCT-ND; RoHS: RoHS Compliant; Category: Resistors; Stock 1: 529147; Pricing 1: 1=0.07, 50=0.0128, 100=0.0097, 250=0.0072, 500=0.00532, 1000=0.00355, 5000=0.0025 (GBP); Packaging: Cut Tape (CT); Tolerance: ±1%; Composition: Thick Film; Features: -; Package / Case: 0402 (1005 Metric); Supplier Device Package: 0402; Size / Dimension: 0.039" L x 0.020" W (1.00mm x 0.50mm); Height: 0.016" (0.40mm); Number of Terminations: 2; ComponentLink1URL: http://industrial.panasonic.com/www-cgi/jvcr13pz.cgi?E+PZ+3+AOA0002+ERJ2RKF2201X+7+WW; ComponentLink1Description: http://industrial.panasonic.com/www-cgi/jvcr13pz.cgi?E+PZ+3+AOA0002+ERJ2RKF2201X+7+WW; Resistance (Ohms): 2.2K
R27-R29 R31 = 10K: RES 10K OHM 1/10W 1% 0402 SMD; Manufacturer: Panasonic Electronic Components; Manufacturer Part Number: ERJ-2RKF1002X; Power (Watts): 0.1W, 1/10W; Temperature Coefficient: ±100ppm/°C; Supplier 1: Digi-Key; Supplier Part Number 1: P10.0KLCT-ND; RoHS: RoHS Compliant; Category: Resistors; Stock 1: 4805447; Pricing 1: 1=0.07, 50=0.0128, 100=0.0097, 250=0.0072, 500=0.00532, 1000=0.00355, 5000=0.0025 (GBP); Packaging: Cut Tape (CT); Tolerance: ±1%; Composition: Thick Film; Features: -; Package / Case: 0402 (1005 Metric); Supplier Device Package: 0402; Size / Dimension: 0.039" L x 0.020" W (1.00mm x 0.50mm); Height: 0.016" (0.40mm); Number of Terminations: 2; ComponentLink1URL: http://industrial.panasonic.com/www-cgi/jvcr13pz.cgi?E+PZ+3+AOA0002+ERJ2RKF1002X+7+WW; ComponentLink1Description: http://industrial.panasonic.com/www-cgi/jvcr13pz.cgi?E+PZ+3+AOA0002+ERJ2RKF1002X+7+WW; Resistance (Ohms): 10K
R30 = 12K: RES 12K OHM 1/10W 1% 0402 SMD; Manufacturer: Panasonic Electronic Components; Manufacturer Part Number: ERJ-2RKF1202X; Power (Watts): 0.1W, 1/10W; Temperature Coefficient: ±100ppm/°C; Supplier 1: Digi-Key; Supplier Part Number 1: P12.0KLCT-ND; RoHS: RoHS Compliant; Category: Resistors; Stock 1: 165467; Pricing 1: 1=0.07, 50=0.0128, 100=0.0097, 250=0.0072, 500=0.00532, 1000=0.00355, 5000=0.0025 (GBP); Packaging: Cut Tape (CT); Tolerance: ±1%; Composition: Thick Film; Features: -; Package / Case: 0402 (1005 Metric); Supplier Device Package: 0402; Size / Dimension: 0.039" L x 0.020" W (1.00mm x 0.50mm); Height: 0.016" (0.40mm); Number of Terminations: 2; ComponentLink1URL: http://industrial.panasonic.com/www-cgi/jvcr13pz.cgi?E+PZ+3+AOA0002+ERJ2RKF1202X+7+WW; ComponentLink1Description: http://industrial.panasonic.com/www-cgi/jvcr13pz.cgi?E+PZ+3+AOA0002+ERJ2RKF1202X+7+WW; Resistance (Ohms): 12K
R44-R50 = 33R: RES 33 OHM 1/10W 1% 0402 SMD; Manufacturer: Panasonic Electronic Components; Manufacturer Part Number: ERJ-2RKF33R0X; Power (Watts): 0.1W, 1/10W; Temperature Coefficient: ±100ppm/°C; Supplier 1: Digi-Key; RoHS: RoHS Compliant; Category: Resistors; Stock 1: 533394; Pricing 1: 1=0.07, 50=0.0128, 100=0.0097, 250=0.0072, 500=0.00532, 1000=0.00355, 5000=0.0025 (GBP); Packaging: Cut Tape (CT); Tolerance: ±1%; Composition: Thick Film; Features: -; Package / Case: 0402 (1005 Metric); Supplier Device Package: 0402; Size / Dimension: 0.039" L x 0.020" W (1.00mm x 0.50mm); Height: 0.016" (0.40mm); Number of Terminations: 2; ComponentLink1URL: http://industrial.panasonic.com/www-cgi/jvcr13pz.cgi?E+PZ+3+AOA0002+ERJ2RKF33R0X+7+WW; ComponentLink1Description: http://industrial.panasonic.com/www-cgi/jvcr13pz.cgi?E+PZ+3+AOA0002+ERJ2RKF33R0X+7+WW; Supplier Part Number 1: P33.0LCT-ND; Resistance (Ohms): 33R
U12 = EMI2121MTTAG: IC FILTER COMMON MODE ESD 8WDFN; Manufacturer: ON Semiconductor; PCN Assembly/Origin: DFN Pkg Filters 12/Jun/2013 Addition of FAB 10 Wafer Source 04/Nov/2013 Assembly Site Addition 06/Mar/2014; Filter Type: Data, Signal Line; Number of Lines: 2; Current: 100mA; DC Resistance (DCR): 8 Ohm; Online Catalog: EMI; Other Names: EMI2121MTTAGOSDKR; Supplier 1: Digikey; Manufacturer Part Number: EMI2121MTTAG; Stock 1: 2368; Pricing 1: 1=0.85, 10=0.76, 100=0.5923, 500=0.4893, 1000=0.3863 (USD); Standard Package: 1; Category: Filters; Family: Common Mode Chokes; Series: -; Packaging: Digi-Reel®; Inductance: -; Impedance: -; Mounting Type: Surface Mount; Size / Dimension: 0.087" L x 0.079" W (2.20mm x 2.00mm); Height (Max): 0.031" (0.80mm); Package / Case: 8-WFDFN Exposed Pad; Operating Temperature: -40°C ~ 85°C; ComponentLink1URL: https://datasheet.ciiva.com/3067/emi2121mt-d-3067884.pdf; ComponentLink1Description: https://datasheet.ciiva.com/3067/emi2121mt-d-3067884.pdf; ComponentLink2URL: https://datasheet.ciiva.com/12394/emi2121mt-d-72518-12394918.pdf; ComponentLink2Description: https://datasheet.ciiva.com/12394/emi2121mt-d-72518-12394918.pdf; ComponentLink3URL: https://datasheet.ciiva.com/6214/emi2121mt-d-6214625.pdf; ComponentLink3Description: https://datasheet.ciiva.com/6214/emi2121mt-d-6214625.pdf; ComponentLink4URL: https://datasheet.ciiva.com/16437/emi2121mt-d-16437709.pdf; ComponentLink4Description: https://datasheet.ciiva.com/16437/emi2121mt-d-16437709.pdf; ComponentLink5URL: https://datasheet.ciiva.com/6214/emi2121mt-d-6214622.pdf; ComponentLink5Description: https://datasheet.ciiva.com/6214/emi2121mt-d-6214622.pdf; ComponentLink6URL: https://datasheet.ciiva.com/6214/emi2121mt-d-6214619.pdf; ComponentLink6Description: https://datasheet.ciiva.com/6214/emi2121mt-d-6214619.pdf; ComponentLink7URL: https://datasheet.ciiva.com/15162/getdatasheetpartid-686641-15162525.pdf; ComponentLink7Description: https://datasheet.ciiva.com/15162/getdatasheetpartid-686641-15162525.pdf; Supplier Part Number 1: EMI2121MTTAGOSCT-ND
U13 = LTC6993CS6-2#TRMPBF: LINEAR TECHNOLOGY - LTC6993CS6-2#TRMPBF - GENERATOR, PULSE, TIMERBLOX, 6SOT-23; Supply Voltage Min: 2.25; Supply Voltage Max: 5.5; Digital IC Case: TSOT-23; No. of Pins: 6; SVHC: No SVHC (17-Dec-2015); Clock External Input: No; No. of Timers: 1; Operating Mode: Monostable; Resonator Case: SMD; Supply Voltage Range: 2.25V to 5.5V<!--FANDB--><div class="features-and-benefits-container"><div class="features-and-benefits-description"><span class="features-benefits-value">The LTC6993CS6-2#TRMPBF is a Monostable Pulse Generator (one shot) with a programmable pulse width of 1?s to 33.6 seconds. The LTC6993 is part of the TimerBlox&reg; Supplier 1: Farnell; Manufacturer: LINEAR TECHNOLOGY; Manufacturer Part Number: LTC6993CS6-2#TRMPBF; RoHS: YES; Stock 1: 1214; Pricing 1: 1=2.64, 25=2.02, 100=1.18 (GBP); Frequency: -; Operating Temperature Min: 0; Operating Temperature Max: 70; Packaging: Cut Tape; Product Range: -; MSL: MSL 1 - Unlimited; Operating Temperature Range: 0°C to +70; ComponentLink1URL: http://www.farnell.com/datasheets/1441932.pdf; ComponentLink1Description: http://www.farnell.com/datasheets/1441932.pdf; ComponentLink2URL: http://www.farnell.com/simulation/1753930.zip; ComponentLink2Description: http://www.farnell.com/simulation/1753930.zip; ComponentLink3URL: http://www.farnell.com/datasheets/1999324.pdf; ComponentLink3Description: http://www.farnell.com/datasheets/1999324.pdf; ComponentLink4URL: http://www.farnell.com/cad/1542631.zip; ComponentLink4Description: http://www.farnell.com/cad/1542631.zip; Supplier Part Number 1: 1848054
U14 = 93LC56BT-I/OT: IC EEPROM 2KBIT 2MHZ SOT23-6; Manufacturer: Microchip Technology; Format - Memory: EEPROMs - Serial; Memory Size: 2K (128 x 16); Interface: Microwire, 3-Wire Serial; Voltage - Supply: 2.5 V ~ 5.5 V; Supplier 1: Digi-Key; Manufacturer Part Number: 93LC56BT-I/OT; RoHS: RoHS Compliant; Category: Integrated Circuits (ICs); Stock 1: 13464; Pricing 1: 1=0.17, 25=0.164, 100=0.1612 (GBP); Packaging: Cut Tape (CT); Part Status: Active; Memory Type: EEPROM; Speed: 2MHz; Operating Temperature: -40°C ~ 85°C (TA); Package / Case: SOT-23-6; Supplier Device Package: SOT-23-6; ComponentLink1URL: http://www.microchip.com/mymicrochip/filehandler.aspx?ddocname=en013939; ComponentLink1Description: http://www.microchip.com/mymicrochip/filehandler.aspx?ddocname=en013939; Supplier Part Number 1: 93LC56BT-I/OTCT-ND
U16 = FT4232HQ: IC USB HS QUAD UART/SYNC 64-QFN; Manufacturer: FTDI, Future Technology Devices International Ltd; Manufacturer Part Number: FT4232HQ-REEL; Function: Bridge, USB to UART; Interface: UART; Standards: USB 2.0; Voltage - Supply: 3 V ~ 3.6 V; Current - Supply: 70mA; Supplier 1: Digi-Key; RoHS: RoHS Compliant; Category: Integrated Circuits (ICs); Stock 1: 18296; Pricing 1: 1=5.99, 10=5.785, 50=5.5452, 100=4.6827, 250=4.1692, 500=3.79954 (GBP); Packaging: Cut Tape (CT); Protocol: USB; Operating Temperature: -40°C ~ 85°C; Package / Case: 64-VFQFN Exposed Pad; Supplier Device Package: 64-QFN (9x9); ComponentLink1URL: http://www.ftdichip.com/Support/Documents/DataSheets/ICs/DS_FT4232H.pdf; ComponentLink1Description: http://www.ftdichip.com/Support/Documents/DataSheets/ICs/DS_FT4232H.pdf; Supplier Part Number 1: 768-1027-1-ND
U17 = NC7SZ08P5X: IC GATE AND 1CH 2-INP SC-70-5; Manufacturer: Fairchild Semiconductor; Logic Type: AND Gate; Number of Circuits: 1; Number of Inputs: 2; Voltage - Supply: 1.65 V ~ 5.5 V; Current - Quiescent (Max): 2µA; Current - Output High, Low: 32mA, 32mA; Max Propagation Delay @ V, Max CL: 4.5ns @ 5V, 50pF; Supplier 1: Digi-Key; Manufacturer Part Number: NC7SZ08P5X; RoHS: RoHS Compliant; Category: Integrated Circuits (ICs); Stock 1: 29087; Pricing 1: 1=0.26, 10=0.216, 100=0.1144, 500=0.07526, 1000=0.05127 (GBP); Packaging: Cut Tape (CT); Part Status: Active; Features: -; Logic Level - Low: -; Logic Level - High: -; Operating Temperature: -40°C ~ 85°C; Mounting Type: Surface Mount; Supplier Device Package: SC-70-5; Package / Case: 5-TSSOP, SC-70-5, SOT-353; ComponentLink1URL: http://www.fairchildsemi.com/datasheets/NC/NC7SZ08.pdf; ComponentLink1Description: http://www.fairchildsemi.com/datasheets/NC/NC7SZ08.pdf; Supplier Part Number 1: NC7SZ08P5XCT-ND
U18 = 74LCX126BQX: IC BUFFER QUAD LV N-INV 14DQFN; Manufacturer: Fairchild Semiconductor; Number of Bits: 4; Max Supply Voltage: 3.6V; Min Supply Voltage: 2V; Propagation Delay: 7.8ns; Logic Function: Buffer,Inverting; Low Level Output Current: 24mA; Polarity: Non-Inverting; Number of Bits per Element: 1; High Level Output Current: -24mA; Quiescent Current: 10uA; Supplier 1: Digi-Key; Manufacturer Part Number: 74LCX126BQX; Stock 1: 15117; Pricing 1: 1=0.85, 10=0.744, 100=0.5702, 500=0.4507, 1000=0.3606 (USD); Mount: Surface Mount; Number of Pins: 14; Weight: 0.12g; Contact Plating: Gold; Min Operating Temperature: -40°C; Max Operating Temperature: 85°C; Packaging: Tape and Reel; Number of Channels: 4; Number of Inputs: 4; Number of Outputs: 4; Package Quantity: 3000; Number of Elements: 4; Number of Input Lines: 4; Number of Output Lines: 4; Turn-On Delay Time: 7.8ns; Radiation Hardening: No; Lead Free: Lead Free; ComponentLink1URL: https://datasheet.ciiva.com/26861/74lcx126bqx-26861526.pdf; ComponentLink1Description: https://datasheet.ciiva.com/26861/74lcx126bqx-26861526.pdf; ComponentLink2URL: https://datasheet.ciiva.com/1837/74lcx126-1837158.pdf; ComponentLink2Description: https://datasheet.ciiva.com/1837/74lcx126-1837158.pdf; ComponentLink3URL: https://datasheet.ciiva.com/28425/74lcx126-28425643.pdf; ComponentLink3Description: https://datasheet.ciiva.com/28425/74lcx126-28425643.pdf; ComponentLink4URL: https://datasheet.ciiva.com/1837/74lcx126-1837156.pdf; ComponentLink4Description: https://datasheet.ciiva.com/1837/74lcx126-1837156.pdf; ComponentLink5URL: https://datasheet.ciiva.com/1837/74lcx126-1837157.pdf; ComponentLink5Description: https://datasheet.ciiva.com/1837/74lcx126-1837157.pdf; ComponentLink6URL: https://datasheet.ciiva.com/8306/74lcx126-8306053.pdf; ComponentLink6Description: https://datasheet.ciiva.com/8306/74lcx126-8306053.pdf; Supplier Part Number 1: 74LCX126BQXDKR-ND
X3 = CRYSTAL 12MHz 18pF SMD: CRYSTAL 12.000 MHZ 18PF SMD; Manufacturer: TXC CORPORATION; Manufacturer Part Number: 8Z-12.000MAAJ-T; Frequency Stability: ±30ppm; Operating Mode: Fundamental; ESR: 100R max; Shunt capacitance: 3.0pF max.; Supplier 1: Digi-Key; RoHS: RoHS Compliant; Category: Crystals and Oscillators; Stock 1: 5365; Pricing 1: 1=1.55, 10=1.347, 50=1.1812, 100=0.9326, 500=0.78752, 1000=0.62172 (GBP); Type: MHz Crystal; Frequency Tolerance: ±30ppm; Load Capacitance: 18pF; Operating Temperature: -20°C ~ 70°C; Mounting Type: Surface Mount; Package / Case: 4-SMD, No Lead (DFN, LCC); Size / Dimension: 0.098" L x 0.079" W (2.50mm x 2.00mm); Height: 0.022" (0.55mm); Packaging: Cut Tape (CT); ComponentLink1URL: http://www.txccrystal.com/images/pdf/8z.pdf; ComponentLink1Description: http://www.txccrystal.com/images/pdf/8z.pdf; Supplier Part Number 1: 887-1487-1-ND; Frequency: 12MHz

## Sheet P-MT3620RDB-1-7_Dev.SchDoc: MT3620 RDB Dev
size A3; CompanyName: Microsoft Research; DrawnBy: Stuart Taylor; Revision: 1.7; SheetNumber: 5; SheetTotal: 5; ProjectName: MT3620 Reference Development Board
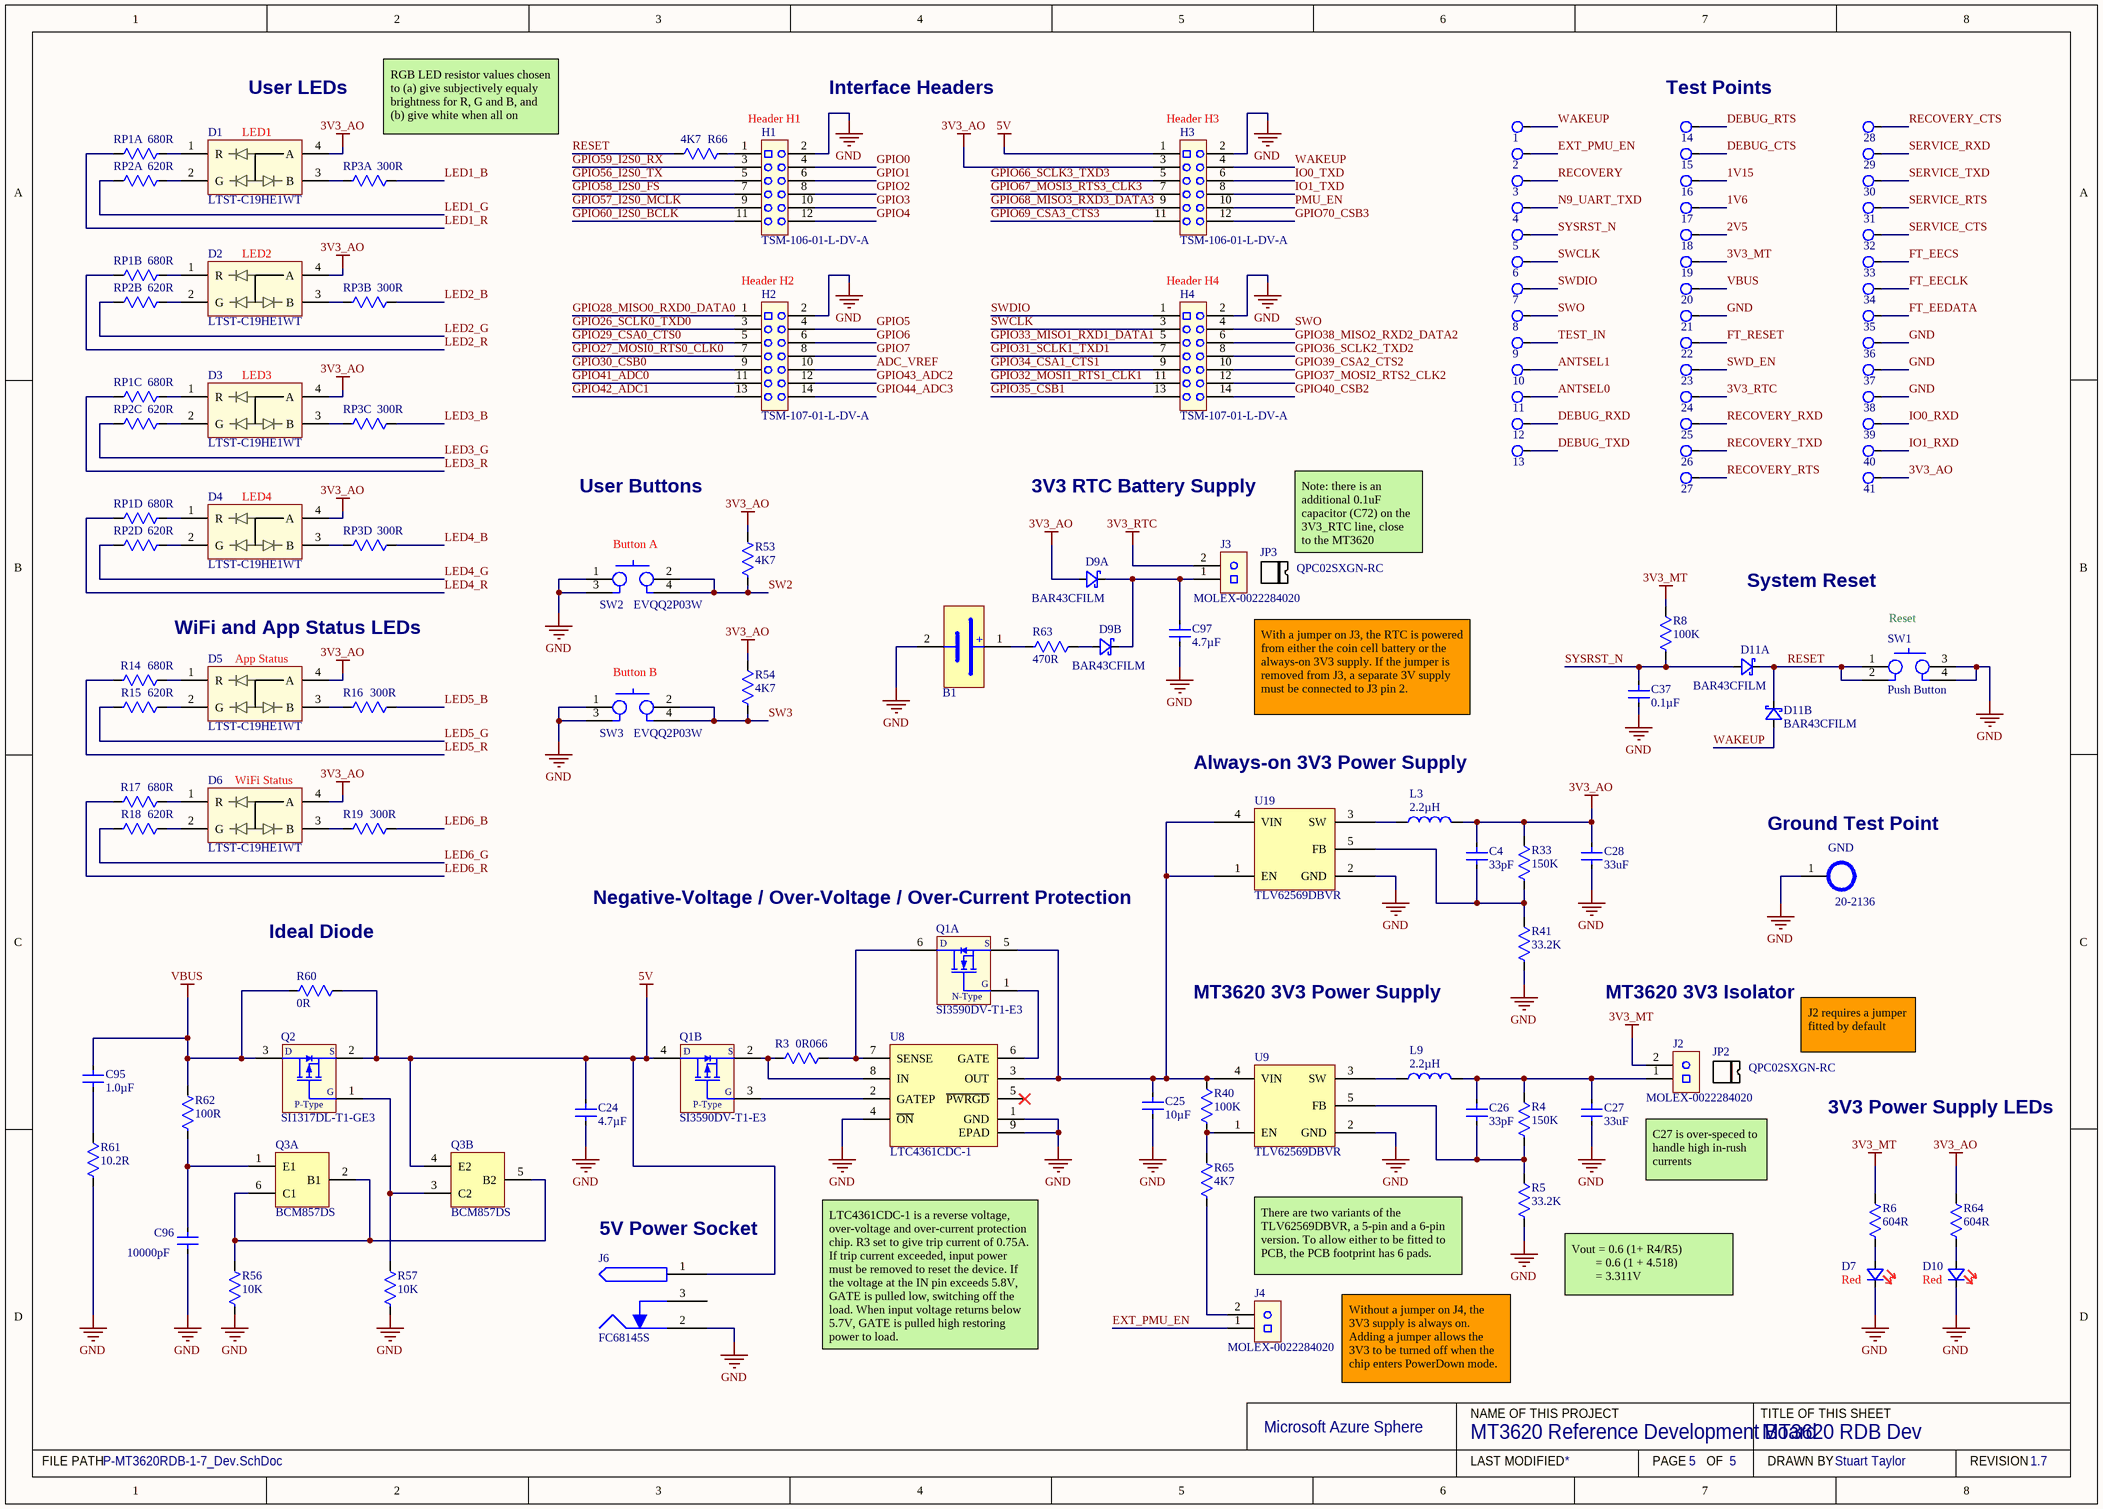
[diagram p4: P-MT3620RDB-1-7_Dev.SchDoc]

### Parts
1  TestPoint  [Pad1.27mm]  (value not drawn)  (no BOM)
2  TestPoint  [Pad1.27mm]  (value not drawn)  (no BOM)
3  TestPoint  [Pad1.27mm]  (value not drawn)  (no BOM)
4  TestPoint  [Pad1.27mm]  (value not drawn)  (no BOM)
5  TestPoint  [Pad1.27mm]  (value not drawn)  (no BOM)
6  TestPoint  [Pad1.27mm]  (value not drawn)  (no BOM)
7  TestPoint  [Pad1.27mm]  (value not drawn)  (no BOM)
8  TestPoint  [Pad1.27mm]  (value not drawn)  (no BOM)
9  TestPoint  [Pad1.27mm]  (value not drawn)  (no BOM)
10  TestPoint  [Pad1.27mm]  (value not drawn)  (no BOM)
11  TestPoint  [Pad1.27mm]  (value not drawn)  (no BOM)
12  TestPoint  [Pad1.27mm]  (value not drawn)  (no BOM)
13  TestPoint  [Pad1.27mm]  (value not drawn)  (no BOM)
14  TestPoint  [Pad1.27mm]  (value not drawn)  (no BOM)
15  TestPoint  [Pad1.27mm]  (value not drawn)  (no BOM)
16  TestPoint  [Pad1.27mm]  (value not drawn)  (no BOM)
17  TestPoint  [Pad1.27mm]  (value not drawn)  (no BOM)
18  TestPoint  [Pad1.27mm]  (value not drawn)  (no BOM)
19  TestPoint  [Pad1.27mm]  (value not drawn)  (no BOM)
20  TestPoint  [Pad1.27mm]  (value not drawn)  (no BOM)
21  TestPoint  [Pad1.27mm]  (value not drawn)  (no BOM)
22  TestPoint  [Pad1.27mm]  (value not drawn)  (no BOM)
23  TestPoint  [Pad1.27mm]  (value not drawn)  (no BOM)
24  TestPoint  [Pad1.27mm]  (value not drawn)  (no BOM)
25  TestPoint  [Pad1.27mm]  (value not drawn)  (no BOM)
26  TestPoint  [Pad1.27mm]  (value not drawn)  (no BOM)
27  TestPoint  [Pad1.27mm]  (value not drawn)  (no BOM)
28  TestPoint  [Pad1.27mm]  (value not drawn)  (no BOM)
29  TestPoint  [Pad1.27mm]  (value not drawn)  (no BOM)
30  TestPoint  [Pad1.27mm]  (value not drawn)  (no BOM)
31  TestPoint  [Pad1.27mm]  (value not drawn)  (no BOM)
32  TestPoint  [Pad1.27mm]  (value not drawn)  (no BOM)
33  TestPoint  [Pad1.27mm]  (value not drawn)  (no BOM)
34  TestPoint  [Pad1.27mm]  (value not drawn)  (no BOM)
35  TestPoint  [Pad1.27mm]  (value not drawn)  (no BOM)
36  TestPoint  [Pad1.27mm]  (value not drawn)  (no BOM)
37  TestPoint  [Pad1.27mm]  (value not drawn)  (no BOM)
38  TestPoint  [Pad1.27mm]  (value not drawn)  (no BOM)
39  TestPoint  [Pad1.27mm]  (value not drawn)  (no BOM)
40  TestPoint  [Pad1.27mm]  (value not drawn)  (no BOM)
41  TestPoint  [Pad1.27mm]  (value not drawn)  (no BOM)
B1  HARWIN-S8421-45R  [HARWIN-S8421-45R]  (value not drawn)
C4  33pF  [CAPC1005-EIA0402 0.55MM MED]
C24  4.7µF  [CAPC1005-EIA0402 0.55MM MED]
C25  10µF  [CAPC1608-EIA0603-1MM-MED]
C26  33pF  [CAPC1005-EIA0402 0.55MM MED]
C27  33uF  [TDK_0805]
C28  33uF  [TDK_0805]
C37  0.1µF  [CAPC1005-EIA0402 0.55MM MED]
C95  1.0µF  [CAPC1005-EIA0402 0.55MM MED]
C96  10000pF  [CAPC1005-EIA0402 0.55MM MED]
C97  4.7µF  [CAPC1005-EIA0402 0.55MM MED]
D1  LTST-C19HE1WT  [LTST-C19HE1WT]
D2  LTST-C19HE1WT  [LTST-C19HE1WT]
D3  LTST-C19HE1WT  [LTST-C19HE1WT]
D4  LTST-C19HE1WT  [LTST-C19HE1WT]
D5  LTST-C19HE1WT  [LTST-C19HE1WT]
D6  LTST-C19HE1WT  [LTST-C19HE1WT]
D7  Colour: Red  [Rohm SML-D12 Red]  (hidden comment: Red LED)
D9  BAR43CFILM  [ON_SEMI-SOT23-3]  (parts A,B of 2)
D10  Colour: Red  [Rohm SML-D12 Red]  (hidden comment: Red LED)
D11  BAR43CFILM  [ON_SEMI-SOT23-3]  (parts A,B of 2)
GND  20-2136  [20-2136]
H1  TSM-106-01-L-DV-A  [TSM-106-01-L-DV-A]
H2  TSM-107-01-L-DV-A  [TSM-107-01-L-DV-A]
H3  TSM-106-01-L-DV-A  [TSM-106-01-L-DV-A]
H4  TSM-107-01-L-DV-A  [TSM-107-01-L-DV-A]
J2  MOLEX-0022284020  [0022284020]
J3  MOLEX-0022284020  [0022284020]
J4  MOLEX-0022284020  [0022284020]
J6  FC68145S  [FC68145S]
JP2  QPC02SXGN-RC  (mechanical)
JP3  QPC02SXGN-RC  (mechanical)
L3  2.2µH  [NR3015T2R2M]
L9  2.2µH  [NR3015T2R2M]
Q1  SI3590DV-T1-E3  [SI3590DV-T1-E3]  (parts A,B of 2)
Q2  SI1317DL-T1-GE3  [VISHAY_SOT-323]
Q3  BCM857DS  [NXP-SOT457]  (parts A,B of 2)
R3  0R066  [VISHAY-0603]
R4  150K  [RES 0402 MEDIUM DENSITY]
R5  33.2K  [RES 0402 MEDIUM DENSITY]
R6  604R  [RES 0402 MEDIUM DENSITY]
R8  100K  [RES 0402 MEDIUM DENSITY]
R14  680R  [RES 0402 MEDIUM DENSITY]
R15  620R  [RES 0402 MEDIUM DENSITY]
R16  300R  [RES 0402 MEDIUM DENSITY]
R17  680R  [RES 0402 MEDIUM DENSITY]
R18  620R  [RES 0402 MEDIUM DENSITY]
R19  300R  [RES 0402 MEDIUM DENSITY]
R33  150K  [RES 0402 MEDIUM DENSITY]
R40  100K  [RES 0402 MEDIUM DENSITY]
R41  33.2K  [RES 0402 MEDIUM DENSITY]
R53  4K7  [RES 0402 MEDIUM DENSITY]
R54  4K7  [RES 0402 MEDIUM DENSITY]
R56  10K  [RES 0402 MEDIUM DENSITY]
R57  10K  [RES 0402 MEDIUM DENSITY]
R60  0R  [RES 0402 MEDIUM DENSITY]
R61  10.2R  [RES 0402 MEDIUM DENSITY]
R62  100R  [RES 0402 MEDIUM DENSITY]
R63  470R  [RES 0402 MEDIUM DENSITY]
R64  604R  [RES 0402 MEDIUM DENSITY]
R65  4K7  [RES 0402 MEDIUM DENSITY]
R66  4K7  [RES 0402 MEDIUM DENSITY]
RP1  680R  [EXB-N8V]  (parts A,B,C,D of 4)
RP2  620R  [EXB-N8V]  (parts A,B,C,D of 4)
RP3  300R  [EXB-N8V]  (parts A,B,C,D of 4)
SW1  Push Button  [DHT-1158]
SW2  SWI TACT SPN0 PANASONIC EVQQ2P03W  [EVQQ2P03W]  (value not drawn)
SW3  SWI TACT SPN0 PANASONIC EVQQ2P03W  [EVQQ2P03W]  (value not drawn)
U8  LTC4361CDC-1  [LTC4361-1#TRPBF]
U9  TLV62569DBVR  [TI-SOT23-6]
U19  TLV62569DBVR  [TI-SOT23-6]

### Nets
3V3_AO: 41.1 C4.2 C28.2 D1.4(A) D2.4(A) D3.4(A) D4.4(A) D5.4(A) D6.4(A) D9.1(A1) H3.3 L3.2 R33.1 R53.1 R54.1 R64.1
3V3_MT: 19.1 J2.2 R6.1 R8.1
3V3_RTC: 24.1 J3.2
5V: C24.2 H3.1 J6.1 Q1.4(D2) Q2.2(S) Q3.4(E2) R60.1
GND: 21.1 36.1 37.1 38.1 B1.2(-) C24.1 C25.1 C27.1 C28.1 C37.1 C96.1 C97.1 D7.1(K) D10.1(K) GND.1 H1.2 H2.2 H3.2 H4.2 J6.2 R5.2 R41.2 R56.2 R57.2 R61.2 SW1.3 SW1.4 SW2.1 SW2.3 SW3.1 SW3.3 U8.1(GND) U8.4(~{ON}) U8.9(EPAD) U9.2(GND) U19.2(GND)
VBUS: 20.1 C95.2 Q2.3(D) R60.2 R62.1
1V6: 17.1
1V15: 16.1
2V5: 18.1
ADC_VREF: H2.10
ANTSEL0: 11.1
ANTSEL1: 10.1
DEBUG_CTS: 15.1
DEBUG_RTS: 14.1
DEBUG_RXD: 12.1
DEBUG_TXD: 13.1
EXT_PMU_EN: 2.1 J4.1
FT_EECLK: 34.1
FT_EECS: 33.1
FT_EEDATA: 35.1
FT_RESET: 22.1
GPIO0: H1.4
GPIO1: H1.6
GPIO2: H1.8
GPIO3: H1.10
GPIO4: H1.12
GPIO5: H2.4
GPIO6: H2.6
GPIO7: H2.8
GPIO26_SCLK0_TXD0: H2.3
GPIO27_MOSI0_RTS0_CLK0: H2.7
GPIO28_MISO0_RXD0_DATA0: H2.1
GPIO29_CSA0_CTS0: H2.5
GPIO30_CSB0: H2.9
GPIO31_SCLK1_TXD1: H4.7
GPIO32_MOSI1_RTS1_CLK1: H4.11
GPIO33_MISO1_RXD1_DATA1: H4.5
GPIO34_CSA1_CTS1: H4.9
GPIO35_CSB1: H4.13
GPIO36_SCLK2_TXD2: H4.8
GPIO37_MOSI2_RTS2_CLK2: H4.12
GPIO38_MISO2_RXD2_DATA2: H4.6
GPIO39_CSA2_CTS2: H4.10
GPIO40_CSB2: H4.14
GPIO41_ADC0: H2.11
GPIO42_ADC1: H2.13
GPIO43_ADC2: H2.12
GPIO44_ADC3: H2.14
GPIO56_I2S0_TX: H1.5
GPIO57_I2S0_MCLK: H1.9
GPIO58_I2S0_FS: H1.7
GPIO59_I2S0_RX: H1.3
GPIO60_I2S0_BCLK: H1.11
GPIO66_SCLK3_TXD3: H3.5
GPIO67_MOSI3_RTS3_CLK3: H3.7
GPIO68_MISO3_RXD3_DATA3: H3.9
GPIO69_CSA3_CTS3: H3.11
GPIO70_CSB3: H3.12
IO0_RXD: 39.1
IO0_TXD: H3.6
IO1_RXD: 40.1
IO1_TXD: H3.8
LED1_B: RP3.2
LED1_G: RP2.2
LED1_R: RP1.2
LED2_B: RP3.4
LED2_G: RP2.4
LED2_R: RP1.4
LED3_B: RP3.6
LED3_G: RP2.6
LED3_R: RP1.6
LED4_B: RP3.8
LED4_G: RP2.8
LED4_R: RP1.8
LED5_B: R16.1
LED5_G: R15.2
LED5_R: R14.2
LED6_B: R19.1
LED6_G: R18.2
LED6_R: R17.2
N9_UART_TXD: 4.1
PMU_EN: H3.10
RECOVERY: 3.1
RECOVERY_CTS: 28.1
RECOVERY_RTS: 27.1
RECOVERY_RXD: 25.1
RECOVERY_TXD: 26.1
RESET: D11.3(K) R66.1 SW1.1 SW1.2
SERVICE_CTS: 32.1
SERVICE_RTS: 31.1
SERVICE_RXD: 29.1
SERVICE_TXD: 30.1
SW2: R53.2 SW2.2 SW2.4
SW3: R54.2 SW3.2 SW3.4
SWCLK: 6.1 H4.3
SWD_EN: 23.1
SWDIO: 7.1 H4.1
SWO: 8.1 H4.4
SYSRST_N: 5.1 C37.2 D11.1(A1) R8.2
TEST_IN: 9.1
WAKEUP: 1.1 D11.2(A2) H3.4
NetB1_1: B1.1(+) R63.2
NetC4_1: C4.1 R33.2 R41.1 U19.5(FB)
NetC25_2: C25.2 Q1.5(S1) R40.1 U8.3(OUT) U9.4(VIN) U19.1(EN) U19.4(VIN)
NetC26_1: C26.1 R4.2 R5.1 U9.5(FB)
NetC26_2: C26.2 C27.2 J2.1 L9.2 R4.1
NetC95_1: C95.1 R61.1
NetC96_2: C96.2 Q3.1(E1) R62.2
NetC97_2: C97.2 D9.3(K) J3.1
NetD1_1: D1.1(R) RP1.1
NetD1_2: D1.2(G) RP2.1
NetD1_3: D1.3(B) RP3.1
NetD2_1: D2.1(R) RP1.3
NetD2_2: D2.2(G) RP2.3
NetD2_3: D2.3(B) RP3.3
NetD3_1: D3.1(R) RP1.5
NetD3_2: D3.2(G) RP2.5
NetD3_3: D3.3(B) RP3.5
NetD4_1: D4.1(R) RP1.7
NetD4_2: D4.2(G) RP2.7
NetD4_3: D4.3(B) RP3.7
NetD5_1: D5.1(R) R14.1
NetD5_2: D5.2(G) R15.1
NetD5_3: D5.3(B) R16.2
NetD6_1: D6.1(R) R17.1
NetD6_2: D6.2(G) R18.1
NetD6_3: D6.3(B) R19.2
NetD7_2: D7.2(A) R6.2
NetD9_2: D9.2(A2) R63.1
NetD10_2: D10.2(A) R64.2
NetH1_1: H1.1 R66.2
NetJ4_2: J4.2 R65.2
NetL3_1: L3.1 U19.3(SW)
NetL9_1: L9.1 U9.3(SW)
NetQ1_1: Q1.1(G1) U8.6(GATE)
NetQ1_2: Q1.2(S2) R3.2 U8.8(IN)
NetQ1_3: Q1.3(G2) U8.2(GATEP)
NetQ1_6: Q1.6(D1) R3.1 U8.7(SENSE)
NetQ2_1: Q2.1(G) Q3.3(C2) R57.1
NetQ3_2: Q3.2(B1) Q3.5(B2) Q3.6(C1) R56.1
NetR40_2: R40.2 R65.1 U9.1(EN)

Not connected (* = marked no-connect by the designer): J6 3; U8 5(~{PWRGD})*